# Altium project LPCB220__RLOOP__STEPPER_NODE.PrjPCB (part 2 of 2)

## Sheet LPCB220 - REMOTE ACCELS.SchDoc
size A3; Address1: Factory 10; Address2: 9-13 Dingley Avenue, Dandeong, VICTORIA 3175, AUSTRALIA; DocumentNumber: 14; Revision: 1; SheetNumber: 14; SheetTotal: 18; Lockie__PCB_SUB_ASSEMBLY: Remote Accelerometer System; Lockie__PCB_ASSEMBLY: Brake Control; Lockie__LDL: LPCB220; Lockie__PCB_DESCRIPTION: Redundant Stepper Node
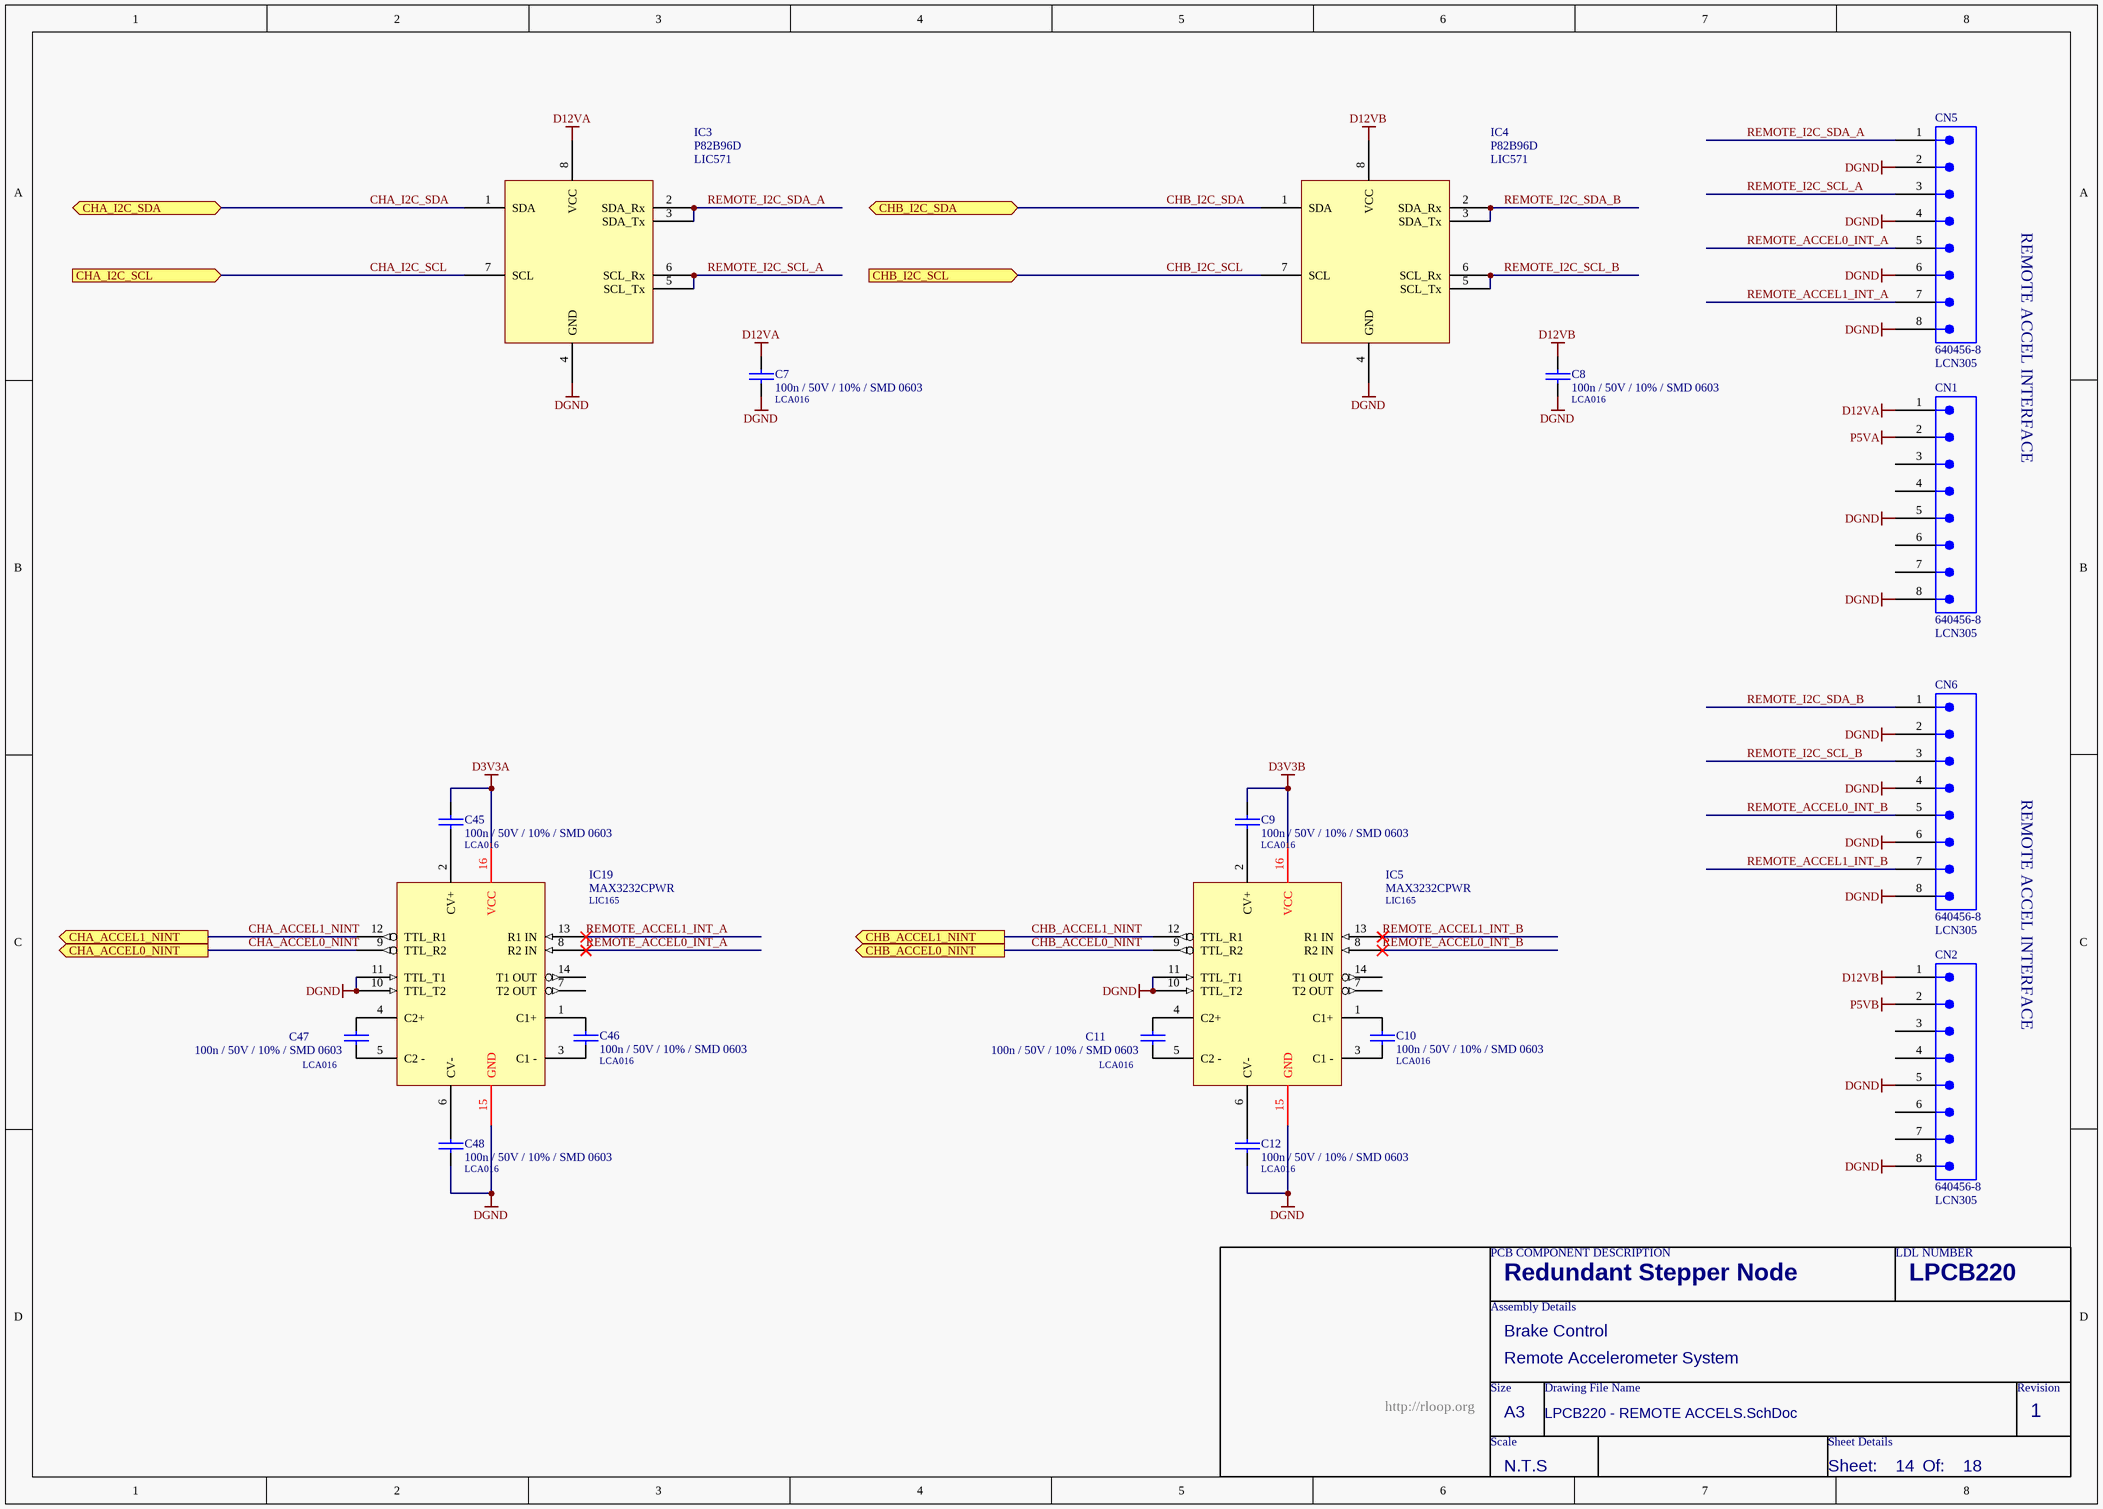
[diagram p12: LPCB220 - REMOTE ACCELS.SchDoc]

### Parts
C7  100n / 50V / 10% / SMD 0603  LDL_NUMBER: LCA016  [LFP011__CC1608-0603-IPC7351_B]
C8  100n / 50V / 10% / SMD 0603  LDL_NUMBER: LCA016  [LFP011__CC1608-0603-IPC7351_B]
C9  100n / 50V / 10% / SMD 0603  LDL_NUMBER: LCA016  [LFP011__CC1608-0603-IPC7351_B]
C10  100n / 50V / 10% / SMD 0603  LDL_NUMBER: LCA016  [LFP011__CC1608-0603-IPC7351_B]
C11  100n / 50V / 10% / SMD 0603  LDL_NUMBER: LCA016  [LFP011__CC1608-0603-IPC7351_B]
C12  100n / 50V / 10% / SMD 0603  LDL_NUMBER: LCA016  [LFP011__CC1608-0603-IPC7351_B]
C45  100n / 50V / 10% / SMD 0603  LDL_NUMBER: LCA016  [LFP011__CC1608-0603-IPC7351_B]
C46  100n / 50V / 10% / SMD 0603  LDL_NUMBER: LCA016  [LFP011__CC1608-0603-IPC7351_B]
C47  100n / 50V / 10% / SMD 0603  LDL_NUMBER: LCA016  [LFP011__CC1608-0603-IPC7351_B]
C48  100n / 50V / 10% / SMD 0603  LDL_NUMBER: LCA016  [LFP011__CC1608-0603-IPC7351_B]
CN1  640456-8  LDL_NUMBER: LCN305  [640456-8]
CN2  640456-8  LDL_NUMBER: LCN305  [640456-8]
CN5  640456-8  LDL_NUMBER: LCN305  [640456-8]
CN6  640456-8  LDL_NUMBER: LCN305  [640456-8]
IC3  P82B96D  LDL_NUMBER: LIC571  [LFP097__SOIC150-8]
IC4  P82B96D  LDL_NUMBER: LIC571  [LFP097__SOIC150-8]
IC5  MAX3232CPWR  LDL_NUMBER: LIC165  [LFP049__TSSOP-16]
IC19  MAX3232CPWR  LDL_NUMBER: LIC165  [LFP049__TSSOP-16]

### Ports
CHA_ACCEL0_NINT (out), CHA_ACCEL1_NINT (out), CHA_I2C_SCL (in), CHA_I2C_SDA (bidir), CHB_ACCEL0_NINT (out), CHB_ACCEL1_NINT (out), CHB_I2C_SCL (in), CHB_I2C_SDA (bidir)

### Nets
D3V3A: C45.1 IC19.16(VCC)
D3V3B: C9.1 IC5.16(VCC)
D12VA: C7.1 CN1.1 IC3.8(VCC)
D12VB: C8.1 CN2.1 IC4.8(VCC)
DGND: C7.2 C8.2 C12.2 C48.2 CN1.5 CN1.8 CN2.5 CN2.8 CN5.2 CN5.4 CN5.6 CN5.8 CN6.2 CN6.4 CN6.6 CN6.8 IC3.4(GND) IC4.4(GND) IC5.10(TTL_T2) IC5.11(TTL_T1) IC5.15(GND) IC19.10(TTL_T2) IC19.11(TTL_T1) IC19.15(GND)
P5VA: CN1.2
P5VB: CN2.2
CHA_ACCEL0_NINT: IC19.9(TTL_R2) ; port CHA_ACCEL0_NINT
CHA_ACCEL1_NINT: IC19.12(TTL_R1) ; port CHA_ACCEL1_NINT
CHA_I2C_SCL: IC3.7(SCL) ; port CHA_I2C_SCL
CHA_I2C_SDA: IC3.1(SDA) ; port CHA_I2C_SDA
CHB_ACCEL0_NINT: IC5.9(TTL_R2) ; port CHB_ACCEL0_NINT
CHB_ACCEL1_NINT: IC5.12(TTL_R1) ; port CHB_ACCEL1_NINT
CHB_I2C_SCL: IC4.7(SCL) ; port CHB_I2C_SCL
CHB_I2C_SDA: IC4.1(SDA) ; port CHB_I2C_SDA
REMOTE_ACCEL0_INT_A: CN5.5 IC19.8(R2_IN)
REMOTE_ACCEL0_INT_B: CN6.5 IC5.8(R2_IN)
REMOTE_ACCEL1_INT_A: CN5.7 IC19.13(R1_IN)
REMOTE_ACCEL1_INT_B: CN6.7 IC5.13(R1_IN)
REMOTE_I2C_SCL_A: CN5.3 IC3.5(SCL_Tx) IC3.6(SCL_Rx)
REMOTE_I2C_SCL_B: CN6.3 IC4.5(SCL_Tx) IC4.6(SCL_Rx)
REMOTE_I2C_SDA_A: CN5.1 IC3.2(SDA_Rx) IC3.3(SDA_Tx)
REMOTE_I2C_SDA_B: CN6.1 IC4.2(SDA_Rx) IC4.3(SDA_Tx)
NetC9_2: C9.2 IC5.2(CV+)
NetC10_1: C10.1 IC5.1(C1+)
NetC10_2: C10.2 IC5.3(C1_-)
NetC11_1: C11.1 IC5.4(C2+)
NetC11_2: C11.2 IC5.5(C2_-)
NetC12_1: C12.1 IC5.6(CV-)
NetC45_2: C45.2 IC19.2(CV+)
NetC46_1: C46.1 IC19.1(C1+)
NetC46_2: C46.2 IC19.3(C1_-)
NetC47_1: C47.1 IC19.4(C2+)
NetC47_2: C47.2 IC19.5(C2_-)
NetC48_1: C48.1 IC19.6(CV-)

Not connected (* = marked no-connect by the designer): CN1 3 4 6 7; CN2 3 4 6 7; IC5 7(T2_OUT) 14(T1_OUT); IC19 7(T2_OUT) 14(T1_OUT)

### Notes on the sheet
- REMOTE ACCEL INTERFACE
- PCB COMPONENT DESCRIPTION
- LDL NUMBER
- Assembly Details
- Size
- Drawing File Name
- Revision
- http://rloop.org
- Scale
- A3
- Sheet Details
- N.T.S
- Sheet:
- Of:

### Library data of the parts
C7 C8 = 100n / 50V / 10% / SMD 0603: as C2 on sheet LPCB220 - BRAKE FAILSAFE; Value: 100n; FMEDA__FUNCTION_IN_SYSTEM: *; FMEDA__OPERATING__VOLTAGE_TYP: 3.3
C9-C12 C45-C48 = 100n / 50V / 10% / SMD 0603: as C37 on sheet LPCB220 - PUSHER INTERLOCK; Value: 100n; FMEDA__FUNCTION_IN_SYSTEM: *; FMEDA__OPERATING__VOLTAGE_TYP: 3.3
CN1 CN2 CN5 CN6 = 640456-8: as CN7 on sheet LPCB220 - BRAKE FAILSAFE; FMEDA__FUNCTION_IN_SYSTEM: *; FMEDA__OPERATING__CURRENT_MIN: 0; FMEDA__OPERATING__CURRENT_TYP: 0; FMEDA__OPERATING__VOLTAGE_MIN: 0
IC3 IC4 = P82B96D: IC, I2C Line Driver [LIC571]
IC5 IC19 = MAX3232CPWR: as IC17 on sheet LPCB220 - PUSHER INTERLOCK; FMEDA__FUNCTION_IN_SYSTEM: *; FMEDA__OPERATING__VOLTAGE_TYP: 3.3

## Sheet LPCB220 - CORE B.SchDoc
size A3; Address1: Factory 10; Address2: 9-13 Dingley Avenue, Dandeong, VICTORIA 3175, AUSTRALIA; DocumentNumber: 5; Revision: 1; SheetNumber: 5; SheetTotal: 18; Lockie__PCB_SUB_ASSEMBLY: Node Core B; Lockie__PCB_ASSEMBLY: Brake Control; Lockie__LDL: LPCB220; Lockie__PCB_DESCRIPTION: Redundant Stepper Node
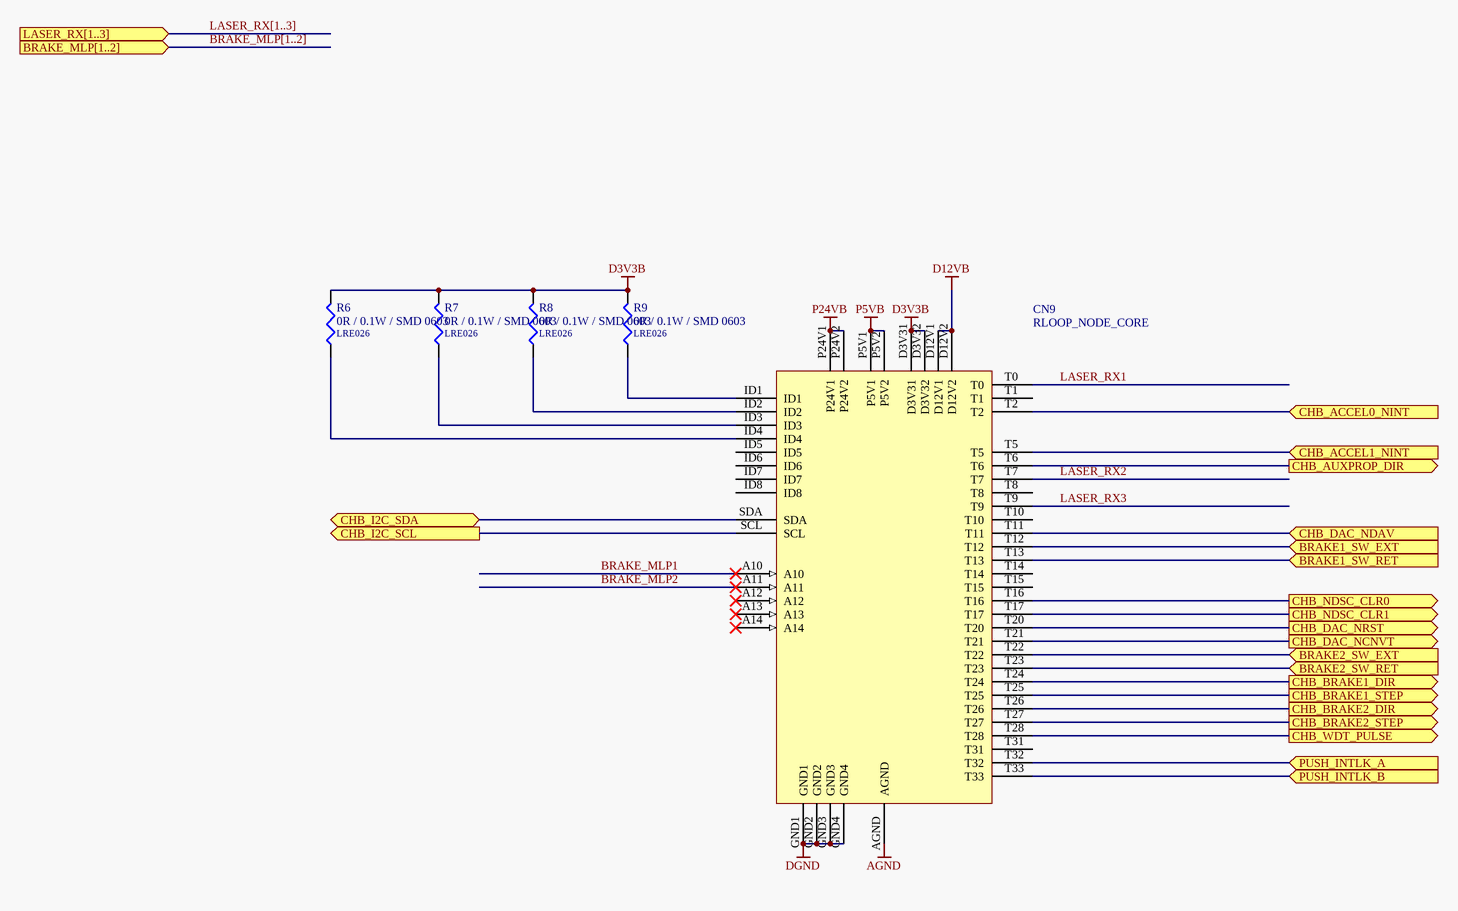
[diagram p13: LPCB220 - CORE B.SchDoc]

### Parts
CN9  RLOOP_NODE_CORE  [RLOOP_NODE_CORE]  (no BOM)
R6  0R / 0.1W / SMD 0603  LDL_NUMBER: LRE026  [LFP020__CR1608-0603-IPC7351_B]
R7  0R / 0.1W / SMD 0603  LDL_NUMBER: LRE026  [LFP020__CR1608-0603-IPC7351_B]
R8  0R / 0.1W / SMD 0603  LDL_NUMBER: LRE026  [LFP020__CR1608-0603-IPC7351_B]
R9  0R / 0.1W / SMD 0603  LDL_NUMBER: LRE026  [LFP020__CR1608-0603-IPC7351_B]

### Ports
BRAKE1_SW_EXT (in), BRAKE1_SW_RET (in), BRAKE2_SW_EXT (in), BRAKE2_SW_RET (in), BRAKE_MLP[1..2] (in), CHB_ACCEL0_NINT (in), CHB_ACCEL1_NINT (in), CHB_AUXPROP_DIR (out), CHB_BRAKE1_DIR (out), CHB_BRAKE1_STEP (out), CHB_BRAKE2_DIR (out), CHB_BRAKE2_STEP (out), CHB_DAC_NCNVT (out), CHB_DAC_NDAV (in), CHB_DAC_NRST (out), CHB_I2C_SCL (out), CHB_I2C_SDA (bidir), CHB_NDSC_CLR0 (out), CHB_NDSC_CLR1 (out), CHB_WDT_PULSE (out), LASER_RX[1..3] (in), PUSH_INTLK_A (in), PUSH_INTLK_B (in)

### Nets
AGND: CN9.AGND
D3V3B: CN9.D3V31 CN9.D3V32 R6.2 R7.2 R8.2 R9.2
D12VB: CN9.D12V1 CN9.D12V2
DGND: CN9.GND1 CN9.GND2 CN9.GND3 CN9.GND4
P5VB: CN9.P5V1 CN9.P5V2
P24VB: CN9.P24V1 CN9.P24V2
BRAKE1_SW_EXT: CN9.T12 ; port BRAKE1_SW_EXT
BRAKE1_SW_RET: CN9.T13 ; port BRAKE1_SW_RET
BRAKE2_SW_EXT: CN9.T22 ; port BRAKE2_SW_EXT
BRAKE2_SW_RET: CN9.T23 ; port BRAKE2_SW_RET
BRAKE_MLP1: CN9.A10
BRAKE_MLP2: CN9.A11
CHB_ACCEL0_NINT: CN9.T2 ; port CHB_ACCEL0_NINT
CHB_ACCEL1_NINT: CN9.T5 ; port CHB_ACCEL1_NINT
CHB_AUXPROP_DIR: CN9.T6 ; port CHB_AUXPROP_DIR
CHB_BRAKE1_DIR: CN9.T24 ; port CHB_BRAKE1_DIR
CHB_BRAKE1_STEP: CN9.T25 ; port CHB_BRAKE1_STEP
CHB_BRAKE2_DIR: CN9.T26 ; port CHB_BRAKE2_DIR
CHB_BRAKE2_STEP: CN9.T27 ; port CHB_BRAKE2_STEP
CHB_DAC_NCNVT: CN9.T21 ; port CHB_DAC_NCNVT
CHB_DAC_NDAV: CN9.T11 ; port CHB_DAC_NDAV
CHB_DAC_NRST: CN9.T20 ; port CHB_DAC_NRST
CHB_I2C_SCL: CN9.SCL ; port CHB_I2C_SCL
CHB_I2C_SDA: CN9.SDA ; port CHB_I2C_SDA
CHB_NDSC_CLR0: CN9.T16 ; port CHB_NDSC_CLR0
CHB_NDSC_CLR1: CN9.T17 ; port CHB_NDSC_CLR1
CHB_WDT_PULSE: CN9.T28 ; port CHB_WDT_PULSE
LASER_RX1: CN9.T0
LASER_RX2: CN9.T7
LASER_RX3: CN9.T9
PUSH_INTLK_A: CN9.T32 ; port PUSH_INTLK_A
PUSH_INTLK_B: CN9.T33 ; port PUSH_INTLK_B
NetCN9_ID1: CN9.ID1 R9.1
NetCN9_ID2: CN9.ID2 R8.1
NetCN9_ID3: CN9.ID3 R7.1
NetCN9_ID4: CN9.ID4 R6.1

Not connected (* = marked no-connect by the designer): CN9 A12* A13* A14* ID5 ID6 ID7 ID8 T1 T8 T10 T14 T15 T31

### Buses and harness runs
bus BRAKE_MLP[1..2] = port BRAKE_MLP[1..2]
bus LASER_RX[1..3] = port LASER_RX[1..3]

### Notes on the sheet
- PCB COMPONENT DESCRIPTION
- LDL NUMBER
- Assembly Details
- Size
- Drawing File Name
- Revision
- http://rloop.org
- Scale
- A3
- Sheet Details
- N.T.S
- Sheet:
- Of:

### Library data of the parts
CN9 = RLOOP_NODE_CORE: rLoop Node Core Connector; FMEDA__CHANNEL: COM; FMEDA__OPERATING__CURRENT_MAX: 0; FMEDA__OPERATING__TEMP_MAX: 50; FMEDA__OPERATING__TEMP_MIN: -20; FMEDA__OPERATING__TEMP_TYP: 27; FMEDA__OPERATING__VOLTAGE_MAX: 16; FMEDA__OPERATING__VOLTAGE_TYP: 12; FMEDA__OPERATING__CURRENT_MIN: 0; FMEDA__OPERATING__CURRENT_TYP: 0; FMEDA__OPERATING__VOLTAGE_MIN: 0
R6-R9 = 0R / 0.1W / SMD 0603: Resistor, Ceramic Chip, 0R, 0.1W, SMD 0603 [LRE026]; Value: 0; FMEDA__OPERATING__TEMP_MAX: 50; FMEDA__OPERATING__TEMP_MIN: -20; FMEDA__OPERATING__TEMP_TYP: 27; FMEDA__CHANNEL: COM; FMEDA__OPERATING__POWER_MAX: 0; FMEDA__OPERATING__POWER_MIN: 0; FMEDA__OPERATING__VOLTAGE_MAX: 0; FMEDA__OPERATING__VOLTAGE_MIN: 0; FMEDA__OPERATING__VOLTAGE_TYP: 0; FMEDA__FUNCTION_IN_SYSTEM: *

## Sheet LPCB220 - G210X MUX INTERFACE.SchDoc
size A3; Address1: Factory 10; Address2: 9-13 Dingley Avenue, Dandeong, VICTORIA 3175, AUSTRALIA; DocumentNumber: 8; Revision: 1; SheetNumber: 8; SheetTotal: 18; Lockie__PCB_SUB_ASSEMBLY: G210 Multiplexer Interface; Lockie__PCB_ASSEMBLY: Brake Control; Lockie__LDL: LPCB220; Lockie__PCB_DESCRIPTION: Redundant Stepper Node
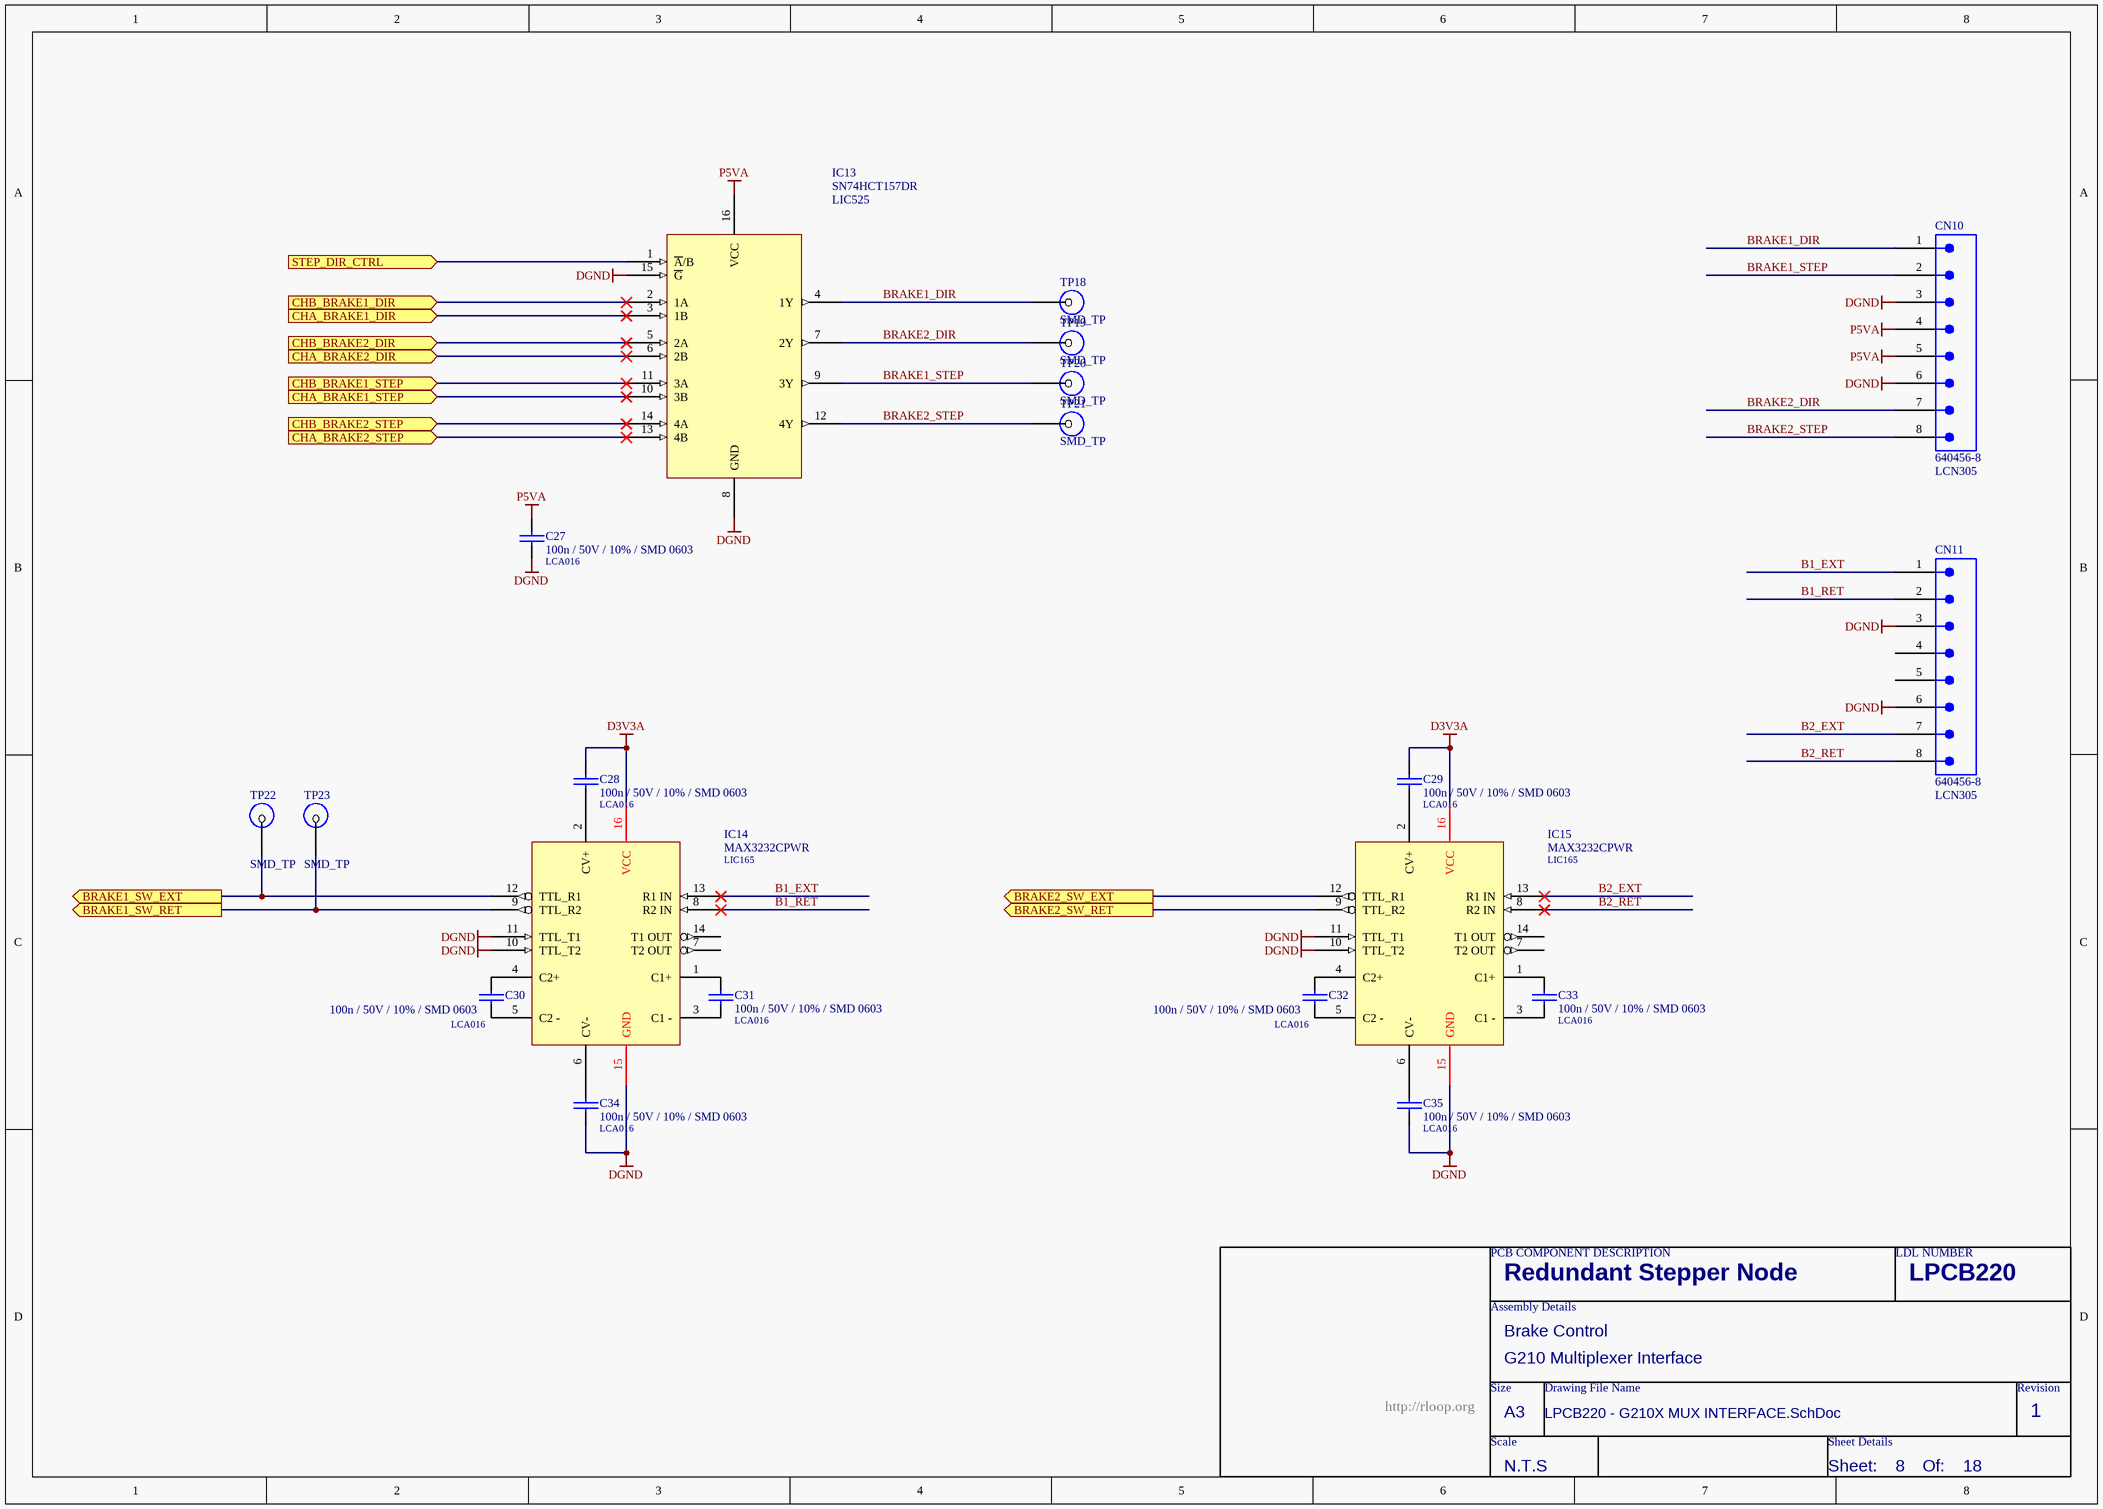
[diagram p14: LPCB220 - G210X MUX INTERFACE.SchDoc]

### Parts
C27  100n / 50V / 10% / SMD 0603  LDL_NUMBER: LCA016  [LFP011__CC1608-0603-IPC7351_B]
C28  100n / 50V / 10% / SMD 0603  LDL_NUMBER: LCA016  [LFP011__CC1608-0603-IPC7351_B]
C29  100n / 50V / 10% / SMD 0603  LDL_NUMBER: LCA016  [LFP011__CC1608-0603-IPC7351_B]
C30  100n / 50V / 10% / SMD 0603  LDL_NUMBER: LCA016  [LFP011__CC1608-0603-IPC7351_B]
C31  100n / 50V / 10% / SMD 0603  LDL_NUMBER: LCA016  [LFP011__CC1608-0603-IPC7351_B]
C32  100n / 50V / 10% / SMD 0603  LDL_NUMBER: LCA016  [LFP011__CC1608-0603-IPC7351_B]
C33  100n / 50V / 10% / SMD 0603  LDL_NUMBER: LCA016  [LFP011__CC1608-0603-IPC7351_B]
C34  100n / 50V / 10% / SMD 0603  LDL_NUMBER: LCA016  [LFP011__CC1608-0603-IPC7351_B]
C35  100n / 50V / 10% / SMD 0603  LDL_NUMBER: LCA016  [LFP011__CC1608-0603-IPC7351_B]
CN10  640456-8  LDL_NUMBER: LCN305  [640456-8]
CN11  640456-8  LDL_NUMBER: LCN305  [640456-8]
IC13  SN74HCT157DR  LDL_NUMBER: LIC525  [LFP079__SOP16]
IC14  MAX3232CPWR  LDL_NUMBER: LIC165  [LFP049__TSSOP-16]
IC15  MAX3232CPWR  LDL_NUMBER: LIC165  [LFP049__TSSOP-16]
TP18  SMD_TP  [SMD-TP]  (no BOM)
TP19  SMD_TP  [SMD-TP]  (no BOM)
TP20  SMD_TP  [SMD-TP]  (no BOM)
TP21  SMD_TP  [SMD-TP]  (no BOM)
TP22  SMD_TP  [SMD-TP]  (no BOM)
TP23  SMD_TP  [SMD-TP]  (no BOM)

### Ports
BRAKE1_SW_EXT (out), BRAKE1_SW_RET (out), BRAKE2_SW_EXT (out), BRAKE2_SW_RET (out), CHA_BRAKE1_DIR (in), CHA_BRAKE1_STEP (in), CHA_BRAKE2_DIR (in), CHA_BRAKE2_STEP (in), CHB_BRAKE1_DIR (in), CHB_BRAKE1_STEP (in), CHB_BRAKE2_DIR (in), CHB_BRAKE2_STEP (in), STEP_DIR_CTRL (in)

### Nets
D3V3A: C28.1 C29.1 IC14.16(VCC) IC15.16(VCC)
DGND: C27.2 C34.2 C35.2 CN10.3 CN10.6 CN11.3 CN11.6 IC13.8(GND) IC13.15(~{G}) IC14.10(TTL_T2) IC14.11(TTL_T1) IC14.15(GND) IC15.10(TTL_T2) IC15.11(TTL_T1) IC15.15(GND)
P5VA: C27.1 CN10.4 CN10.5 IC13.16(VCC)
B1_EXT: CN11.1 IC14.13(R1_IN)
B1_RET: CN11.2 IC14.8(R2_IN)
B2_EXT: CN11.7 IC15.13(R1_IN)
B2_RET: CN11.8 IC15.8(R2_IN)
BRAKE1_DIR: CN10.1 IC13.4(1Y) TP18.1
BRAKE1_STEP: CN10.2 IC13.9(3Y) TP20.1
BRAKE1_SW_EXT: IC14.12(TTL_R1) TP22.1 ; port BRAKE1_SW_EXT
BRAKE1_SW_RET: IC14.9(TTL_R2) TP23.1 ; port BRAKE1_SW_RET
BRAKE2_DIR: CN10.7 IC13.7(2Y) TP19.1
BRAKE2_STEP: CN10.8 IC13.12(4Y) TP21.1
BRAKE2_SW_EXT: IC15.12(TTL_R1) ; port BRAKE2_SW_EXT
BRAKE2_SW_RET: IC15.9(TTL_R2) ; port BRAKE2_SW_RET
CHA_BRAKE1_DIR: IC13.3(1B) ; port CHA_BRAKE1_DIR
CHA_BRAKE1_STEP: IC13.10(3B) ; port CHA_BRAKE1_STEP
CHA_BRAKE2_DIR: IC13.6(2B) ; port CHA_BRAKE2_DIR
CHA_BRAKE2_STEP: IC13.13(4B) ; port CHA_BRAKE2_STEP
CHB_BRAKE1_DIR: IC13.2(1A) ; port CHB_BRAKE1_DIR
CHB_BRAKE1_STEP: IC13.11(3A) ; port CHB_BRAKE1_STEP
CHB_BRAKE2_DIR: IC13.5(2A) ; port CHB_BRAKE2_DIR
CHB_BRAKE2_STEP: IC13.14(4A) ; port CHB_BRAKE2_STEP
STEP_DIR_CTRL: IC13.1(~{A}/B) ; port STEP_DIR_CTRL
NetC28_2: C28.2 IC14.2(CV+)
NetC29_2: C29.2 IC15.2(CV+)
NetC30_1: C30.1 IC14.4(C2+)
NetC30_2: C30.2 IC14.5(C2_-)
NetC31_1: C31.1 IC14.1(C1+)
NetC31_2: C31.2 IC14.3(C1_-)
NetC32_1: C32.1 IC15.4(C2+)
NetC32_2: C32.2 IC15.5(C2_-)
NetC33_1: C33.1 IC15.1(C1+)
NetC33_2: C33.2 IC15.3(C1_-)
NetC34_1: C34.1 IC14.6(CV-)
NetC35_1: C35.1 IC15.6(CV-)

Not connected (* = marked no-connect by the designer): CN11 4 5; IC14 7(T2_OUT) 14(T1_OUT); IC15 7(T2_OUT) 14(T1_OUT)

### Notes on the sheet
- PCB COMPONENT DESCRIPTION
- LDL NUMBER
- Assembly Details
- Size
- Drawing File Name
- Revision
- http://rloop.org
- Scale
- A3
- Sheet Details
- N.T.S
- Sheet:
- Of:

### Library data of the parts
C27 = 100n / 50V / 10% / SMD 0603: Capacitor, Ceramic Chip, 100nF (0.1uF), 50V, 5%, SMD 0603 [LCA016]; FMEDA__OPERATING__VOLTAGE_MIN: 0; FMEDA__OPERATING__VOLTAGE_MAX: 3.3; FMEDA__OPERATING__TEMP_MIN: -20; FMEDA__OPERATING__TEMP_TYP: 27; FMEDA__OPERATING__TEMP_MAX: 50; FMEDA__CHANNEL: COM; Value: 100n; FMEDA__FUNCTION_IN_SYSTEM: *; FMEDA__OPERATING__VOLTAGE_TYP: 3.3
C28-C35 = 100n / 50V / 10% / SMD 0603: Capacitor, Ceramic Chip, 100nF, 50V, 10%, SMD 0603; FMEDA__OPERATING__VOLTAGE_MIN: 0; FMEDA__OPERATING__VOLTAGE_MAX: 3.3; FMEDA__OPERATING__TEMP_MIN: -20; FMEDA__OPERATING__TEMP_TYP: 27; FMEDA__OPERATING__TEMP_MAX: 50; FMEDA__CHANNEL: COM; Value: 100n; FMEDA__FUNCTION_IN_SYSTEM: *; FMEDA__OPERATING__VOLTAGE_TYP: 3.3
CN10 CN11 = 640456-8: Connector, Male Header, 8 Way; FMEDA__CHANNEL: COM; FMEDA__OPERATING__CURRENT_MAX: 0; FMEDA__OPERATING__TEMP_MAX: 50; FMEDA__OPERATING__TEMP_MIN: -20; FMEDA__OPERATING__TEMP_TYP: 27; FMEDA__OPERATING__VOLTAGE_MAX: 16; FMEDA__OPERATING__VOLTAGE_TYP: 12; FMEDA__FUNCTION_IN_SYSTEM: *; FMEDA__OPERATING__CURRENT_MIN: 0; FMEDA__OPERATING__CURRENT_TYP: 0; FMEDA__OPERATING__VOLTAGE_MIN: 0
IC13 = SN74HCT157DR: IC, Multiplexer Select 2-1 [LIC525]; FMEDA__CHANNEL: COM; FMEDA__FUNCTION_IN_SYSTEM: *
IC14 IC15 = MAX3232CPWR: IC, RS232 Line Driver, 3.3V, SMD TSSOP16; FMEDA__OPERATING__TEMP_MAX: 50; FMEDA__OPERATING__TEMP_MIN: -20; FMEDA__OPERATING__TEMP_TYP: 27; FMEDA__CHANNEL: COM; FMEDA__OPERATING__VOLTAGE_MAX: 3.3; FMEDA__OPERATING__VOLTAGE_MIN: 0; FMEDA__FUNCTION_IN_SYSTEM: *; FMEDA__OPERATING__VOLTAGE_TYP: 3.3
TP18-TP23 = SMD_TP: SMD Test Point; FMEDA__CHANNEL: COM; FMEDA__OPERATING__CURRENT_MAX: 0; FMEDA__OPERATING__TEMP_MAX: 50; FMEDA__OPERATING__TEMP_MIN: -20; FMEDA__OPERATING__TEMP_TYP: 27; FMEDA__OPERATING__VOLTAGE_MAX: 16; FMEDA__OPERATING__VOLTAGE_TYP: 12; FMEDA__OPERATING__CURRENT_MIN: 0; FMEDA__OPERATING__CURRENT_TYP: 0; FMEDA__OPERATING__VOLTAGE_MIN: 0

## Sheet LPCB220 - THROTTLE MUX TOP.SchDoc
size A3; Address1: Factory 10; Address2: 9-13 Dingley Avenue, Dandeong, VICTORIA 3175, AUSTRALIA; DocumentNumber: 15; Revision: 1; SheetNumber: 15; SheetTotal: 18; Lockie__PCB_SUB_ASSEMBLY: Throttle Multiplexers; Lockie__PCB_ASSEMBLY: Brake Control; Lockie__LDL: LPCB220; Lockie__PCB_DESCRIPTION: Redundant Stepper Node
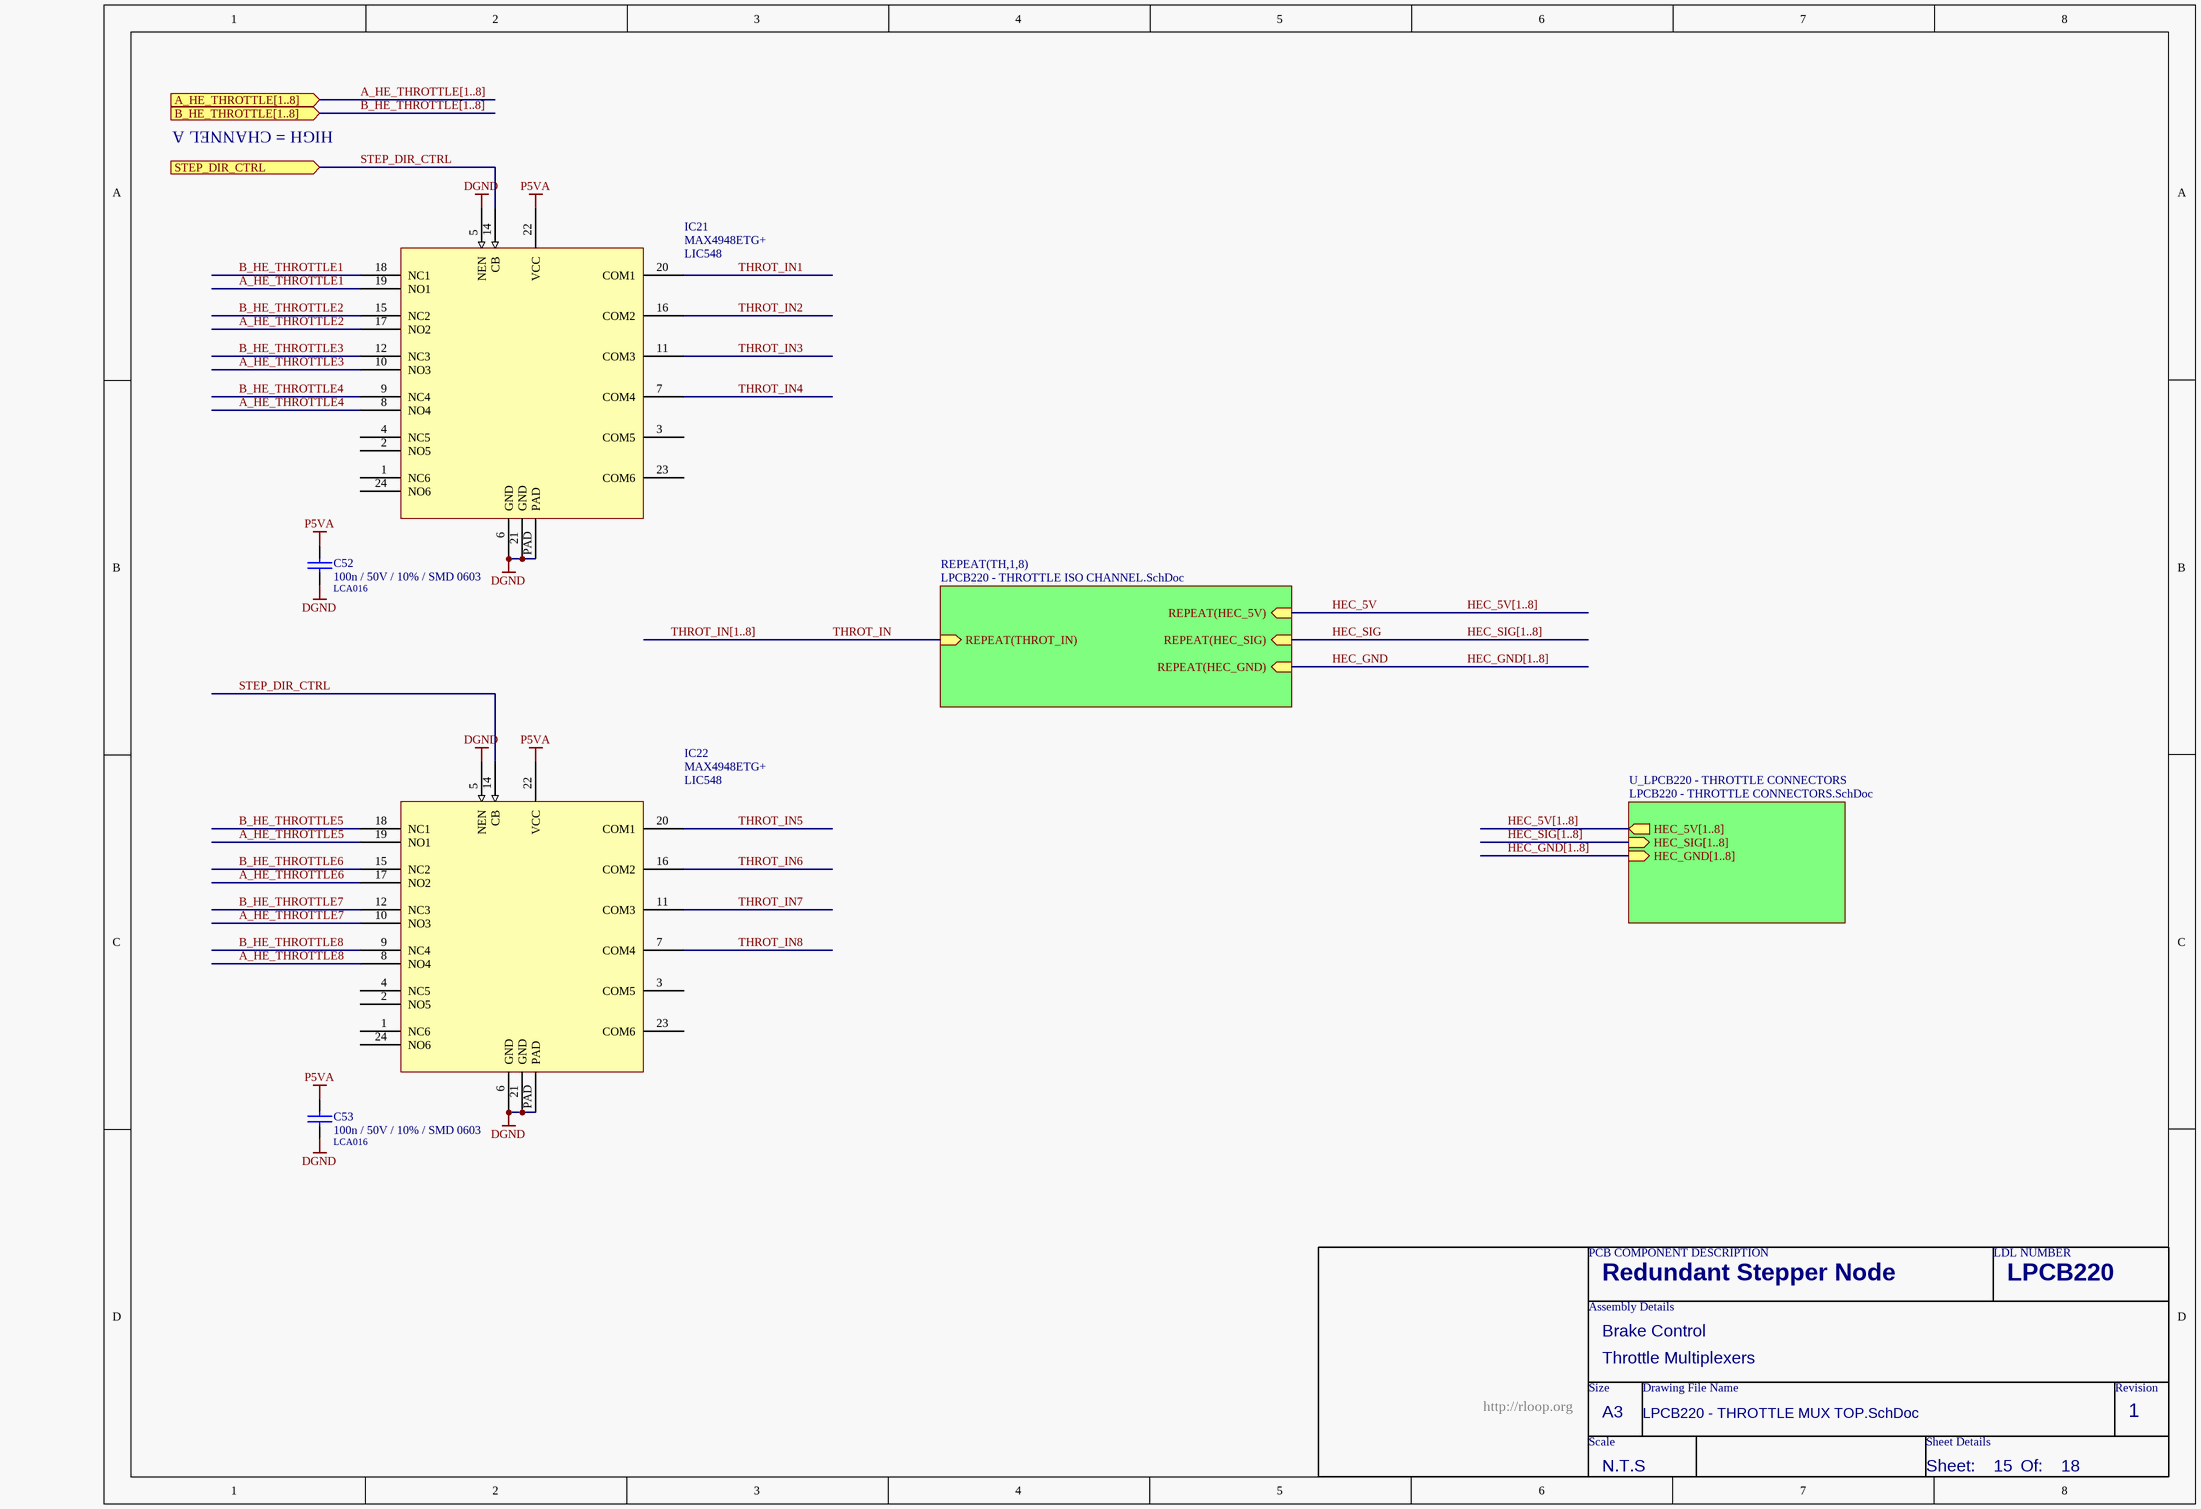
[diagram p15: LPCB220 - THROTTLE MUX TOP.SchDoc]

### Parts
C52  100n / 50V / 10% / SMD 0603  LDL_NUMBER: LCA016  [LFP011__CC1608-0603-IPC7351_B]
C53  100n / 50V / 10% / SMD 0603  LDL_NUMBER: LCA016  [LFP011__CC1608-0603-IPC7351_B]
IC21  MAX4948ETG+  LDL_NUMBER: LIC548  [LFP095__QFN127P600-8N]
IC22  MAX4948ETG+  LDL_NUMBER: LIC548  [LFP095__QFN127P600-8N]

### Sub-sheets
REPEAT(TH,1,8) = LPCB220 - THROTTLE ISO CHANNEL.SchDoc: REPEAT(THROT_IN) (in), REPEAT(HEC_5V) (in), REPEAT(HEC_GND) (in), REPEAT(HEC_SIG) (in)
U_LPCB220 - THROTTLE CONNECTORS = LPCB220 - THROTTLE CONNECTORS.SchDoc: HEC_5V[1..8] (out), HEC_SIG[1..8] (in), HEC_GND[1..8] (in)

### Ports
A_HE_THROTTLE[1..8] (in), B_HE_THROTTLE[1..8] (in), STEP_DIR_CTRL (in)

### Nets
DGND: C52.2 C53.2 IC21.5(NEN) IC21.6(GND) IC21.21(GND) IC21.PAD IC22.5(NEN) IC22.6(GND) IC22.21(GND) IC22.PAD
P5VA: C52.1 C53.1 IC21.22(VCC) IC22.22(VCC)
A_HE_THROTTLE1: IC21.19(NO1)
A_HE_THROTTLE2: IC21.17(NO2)
A_HE_THROTTLE3: IC21.10(NO3)
A_HE_THROTTLE4: IC21.8(NO4)
A_HE_THROTTLE5: IC22.19(NO1)
A_HE_THROTTLE6: IC22.17(NO2)
A_HE_THROTTLE7: IC22.10(NO3)
A_HE_THROTTLE8: IC22.8(NO4)
B_HE_THROTTLE1: IC21.18(NC1)
B_HE_THROTTLE2: IC21.15(NC2)
B_HE_THROTTLE3: IC21.12(NC3)
B_HE_THROTTLE4: IC21.9(NC4)
B_HE_THROTTLE5: IC22.18(NC1)
B_HE_THROTTLE6: IC22.15(NC2)
B_HE_THROTTLE7: IC22.12(NC3)
B_HE_THROTTLE8: IC22.9(NC4)
HEC_5V: sheet REPEAT(TH,1,8)/REPEAT(HEC_5V)
HEC_GND: sheet REPEAT(TH,1,8)/REPEAT(HEC_GND)
HEC_SIG: sheet REPEAT(TH,1,8)/REPEAT(HEC_SIG)
STEP_DIR_CTRL: IC21.14(CB) IC22.14(CB) ; port STEP_DIR_CTRL
THROT_IN: sheet REPEAT(TH,1,8)/REPEAT(THROT_IN)
THROT_IN1: IC21.20(COM1)
THROT_IN2: IC21.16(COM2)
THROT_IN3: IC21.11(COM3)
THROT_IN4: IC21.7(COM4)
THROT_IN5: IC22.20(COM1)
THROT_IN6: IC22.16(COM2)
THROT_IN7: IC22.11(COM3)
THROT_IN8: IC22.7(COM4)

Not connected (* = marked no-connect by the designer): IC21 1(NC6) 2(NO5) 3(COM5) 4(NC5) 23(COM6) 24(NO6); IC22 1(NC6) 2(NO5) 3(COM5) 4(NC5) 23(COM6) 24(NO6)

### Buses and harness runs
bus A_HE_THROTTLE[1..8] = port A_HE_THROTTLE[1..8]
bus B_HE_THROTTLE[1..8] = port B_HE_THROTTLE[1..8]
bus HEC_5V[1..8]
bus HEC_5V[1..8] = sheet U_LPCB220 - THROTTLE CONNECTORS/HEC_5V[1..8]
bus HEC_GND[1..8]
bus HEC_GND[1..8] = sheet U_LPCB220 - THROTTLE CONNECTORS/HEC_GND[1..8]
bus HEC_SIG[1..8]
bus HEC_SIG[1..8] = sheet U_LPCB220 - THROTTLE CONNECTORS/HEC_SIG[1..8]
bus THROT_IN[1..8]

### Notes on the sheet
- HIGH = CHANNEL A
- PCB COMPONENT DESCRIPTION
- LDL NUMBER
- Assembly Details
- Size
- Drawing File Name
- Revision
- http://rloop.org
- Scale
- A3
- Sheet Details
- N.T.S
- Sheet:
- Of:

### Library data of the parts
C52 C53 = 100n / 50V / 10% / SMD 0603: as C27 on sheet LPCB220 - G210X MUX INTERFACE; Value: 100n; FMEDA__FUNCTION_IN_SYSTEM: *; FMEDA__OPERATING__VOLTAGE_TYP: 3.3
IC21 IC22 = MAX4948ETG+: IC, Analog Switch, SMD [LIC548]

## Sheet LPCB220 - THROTTLE ISO CHANNEL.SchDoc
size A3; Address1: Factory 10; Address2: 9-13 Dingley Avenue, Dandeong, VICTORIA 3175, AUSTRALIA; DocumentNumber: 17; Revision: 1; SheetNumber: 17; SheetTotal: 18; Lockie__PCB_SUB_ASSEMBLY: Isolated Throttle Channel; Lockie__PCB_ASSEMBLY: Brake Control; Lockie__LDL: LPCB220; Lockie__PCB_DESCRIPTION: Redundant Stepper Node
Used 8 times, as channels U_LPCB220 - THROTTLE MUX TOP/TH1, U_LPCB220 - THROTTLE MUX TOP/TH2, U_LPCB220 - THROTTLE MUX TOP/TH3, U_LPCB220 - THROTTLE MUX TOP/TH4, U_LPCB220 - THROTTLE MUX TOP/TH5, U_LPCB220 - THROTTLE MUX TOP/TH6, U_LPCB220 - THROTTLE MUX TOP/TH7, U_LPCB220 - THROTTLE MUX TOP/TH8. Parts and nets are listed once, with the designators drawn on the sheet.
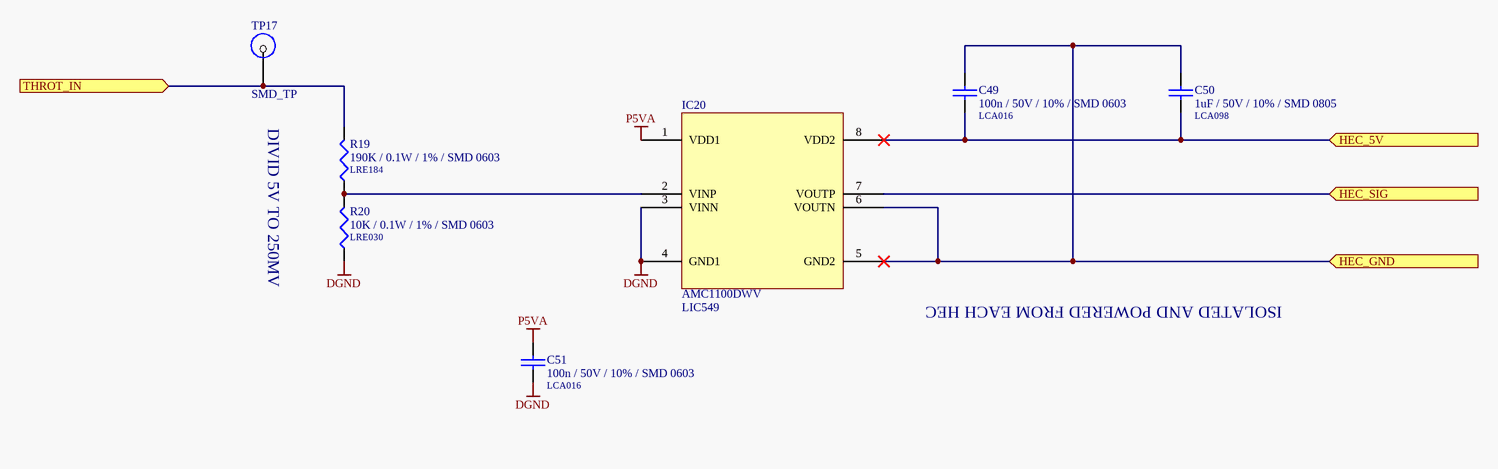
[diagram p16: LPCB220 - THROTTLE ISO CHANNEL.SchDoc]

### Parts
C49  100n / 50V / 10% / SMD 0603  LDL_NUMBER: LCA016  [LFP011__CC1608-0603-IPC7351_B]
C50  1uF / 50V / 10% / SMD 0805  LDL_NUMBER: LCA098  [LFP010__CC2012-0805-IPC7351_B]
C51  100n / 50V / 10% / SMD 0603  LDL_NUMBER: LCA016  [LFP011__CC1608-0603-IPC7351_B]
IC20  AMC1100DWV  LDL_NUMBER: LIC549  [LFP116__R-PDSO-G8]
R19  190K / 0.1W / 1% / SMD 0603  LDL_NUMBER: LRE184  [LFP020__CR1608-0603-IPC7351_B]
R20  10K / 0.1W / 1% / SMD 0603  LDL_NUMBER: LRE030  [LFP020__CR1608-0603-IPC7351_B]
TP17  SMD_TP  [SMD-TP]  (no BOM)

### Ports
HEC_5V (in), HEC_GND (in), HEC_SIG (in), THROT_IN (in)

### Nets
DGND: C51.2 IC20.3(VINN) IC20.4(GND1) R20.1
P5VA: C51.1 IC20.1(VDD1)
HEC_5V: C49.2 C50.2 IC20.8(VDD2) ; port HEC_5V
HEC_GND: C49.1 C50.1 IC20.5(GND2) IC20.6(VOUTN) ; port HEC_GND
HEC_SIG: IC20.7(VOUTP) ; port HEC_SIG
THROT_IN: R19.2 TP17.1 ; port THROT_IN
NetIC20_2: IC20.2(VINP) R19.1 R20.2

### Channels
U_LPCB220 - THROTTLE MUX TOP/TH1: designators end in _TH1; ports HEC_5V=HEC_5V1 HEC_GND=HEC_GND1 HEC_SIG=HEC_SIG1 THROT_IN=THROT_IN1
U_LPCB220 - THROTTLE MUX TOP/TH2: designators end in _TH2; ports HEC_5V=HEC_5V2 HEC_GND=HEC_GND2 HEC_SIG=HEC_SIG2 THROT_IN=THROT_IN2
U_LPCB220 - THROTTLE MUX TOP/TH3: designators end in _TH3; ports HEC_5V=HEC_5V3 HEC_GND=HEC_GND3 HEC_SIG=HEC_SIG3 THROT_IN=THROT_IN3
U_LPCB220 - THROTTLE MUX TOP/TH4: designators end in _TH4; ports HEC_5V=HEC_5V4 HEC_GND=HEC_GND4 HEC_SIG=HEC_SIG4 THROT_IN=THROT_IN4
U_LPCB220 - THROTTLE MUX TOP/TH5: designators end in _TH5; ports HEC_5V=HEC_5V5 HEC_GND=HEC_GND5 HEC_SIG=HEC_SIG5 THROT_IN=THROT_IN5
U_LPCB220 - THROTTLE MUX TOP/TH6: designators end in _TH6; ports HEC_5V=HEC_5V6 HEC_GND=HEC_GND6 HEC_SIG=HEC_SIG6 THROT_IN=THROT_IN6
U_LPCB220 - THROTTLE MUX TOP/TH7: designators end in _TH7; ports HEC_5V=HEC_5V7 HEC_GND=HEC_GND7 HEC_SIG=HEC_SIG7 THROT_IN=THROT_IN7
U_LPCB220 - THROTTLE MUX TOP/TH8: designators end in _TH8; ports HEC_5V=HEC_5V8 HEC_GND=HEC_GND8 HEC_SIG=HEC_SIG8 THROT_IN=THROT_IN8

### Notes on the sheet
- DIVID 5V TO 250MV
- ISOLATED AND POWERED FROM EACH HEC
- PCB COMPONENT DESCRIPTION
- LDL NUMBER
- Assembly Details
- Size
- Drawing File Name
- Revision
- http://rloop.org
- Scale
- A3
- Sheet Details
- N.T.S
- Sheet:
- Of:

### Library data of the parts
C49 C51 = 100n / 50V / 10% / SMD 0603: as C27 on sheet LPCB220 - G210X MUX INTERFACE; Value: 100n; FMEDA__FUNCTION_IN_SYSTEM: *; FMEDA__OPERATING__VOLTAGE_TYP: 3.3
C50 = 1uF / 50V / 10% / SMD 0805: Capacitor, Ceramic Chip, 1uF, 50V, SMD 0805 [LCA098]; Value: 1u; FMEDA__OPERATING__VOLTAGE_MAX: 3.3; FMEDA__OPERATING__VOLTAGE_MIN: 0; FMEDA__OPERATING__TEMP_MAX: 50; FMEDA__OPERATING__TEMP_MIN: -20; FMEDA__OPERATING__TEMP_TYP: 27; FMEDA__CHANNEL: COM; FMEDA__OPERATING__VOLTAGE_TYP: 3.3; FMEDA__FUNCTION_IN_SYSTEM: *
IC20 = AMC1100DWV: IC, Isolation Amplifier, SMD SOIC8 [LIC549]
R19 = 190K / 0.1W / 1% / SMD 0603: Resistor, Ceramic Chip, 190K, 0.1W, 1%, SMD 0603 [LRE184]; FMEDA__OPERATING__POWER_MAX: 0; FMEDA__OPERATING__TEMP_MAX: 50; FMEDA__OPERATING__TEMP_MIN: -20; FMEDA__OPERATING__TEMP_TYP: 27; FMEDA__CHANNEL: COM; Value: 190K; FMEDA__OPERATING__POWER_MIN: 0; FMEDA__OPERATING__VOLTAGE_MAX: 0; FMEDA__OPERATING__VOLTAGE_MIN: 0; FMEDA__OPERATING__VOLTAGE_TYP: 0; FMEDA__FUNCTION_IN_SYSTEM: *
R20 = 10K / 0.1W / 1% / SMD 0603: Resistor, Ceramic Chip, 10K, 0.1W, 1%, SMD 0603 [LRE030]; FMEDA__OPERATING__POWER_MAX: 0; FMEDA__OPERATING__TEMP_MAX: 50; FMEDA__OPERATING__TEMP_MIN: -20; FMEDA__OPERATING__TEMP_TYP: 27; FMEDA__CHANNEL: COM; Value: 10K; FMEDA__OPERATING__POWER_MIN: 0; FMEDA__OPERATING__VOLTAGE_MAX: 0; FMEDA__OPERATING__VOLTAGE_MIN: 0; FMEDA__OPERATING__VOLTAGE_TYP: 0; FMEDA__FUNCTION_IN_SYSTEM: *
TP17 = SMD_TP: as TP18-TP23 on sheet LPCB220 - G210X MUX INTERFACE; FMEDA__OPERATING__CURRENT_MIN: 0; FMEDA__OPERATING__CURRENT_TYP: 0; FMEDA__OPERATING__VOLTAGE_MIN: 0

## Sheet LPCB220 - THROTTLE CONNECTORS.SchDoc
size A3; Address1: Factory 10; Address2: 9-13 Dingley Avenue, Dandeong, VICTORIA 3175, AUSTRALIA; DocumentNumber: 16; Revision: 1; SheetNumber: 16; SheetTotal: 18; Lockie__PCB_SUB_ASSEMBLY: Throttle Connections; Lockie__PCB_ASSEMBLY: Brake Control; Lockie__LDL: LPCB220; Lockie__PCB_DESCRIPTION: Redundant Stepper Node
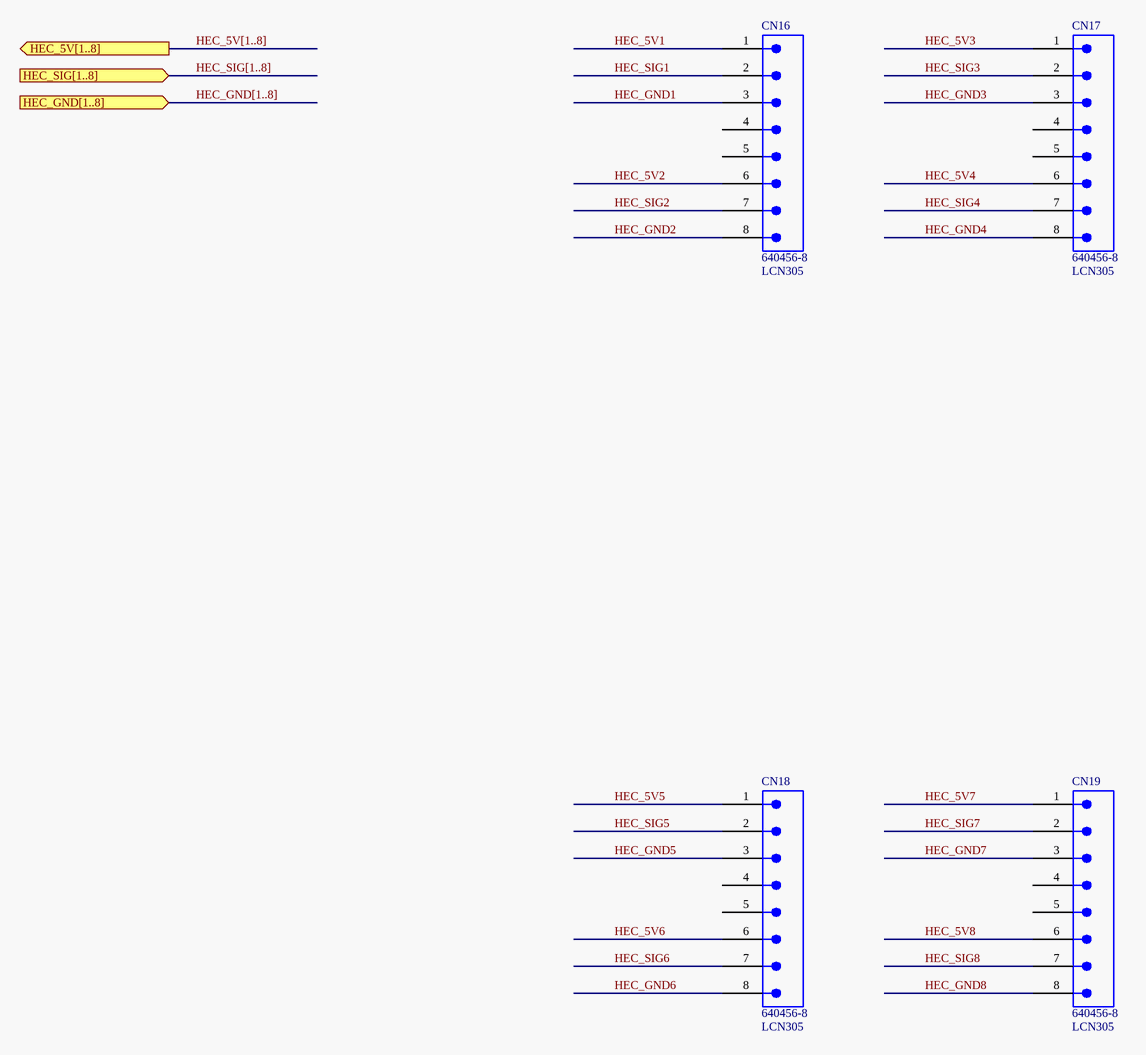
[diagram p17: LPCB220 - THROTTLE CONNECTORS.SchDoc]

### Parts
CN16  640456-8  LDL_NUMBER: LCN305  [640456-8]
CN17  640456-8  LDL_NUMBER: LCN305  [640456-8]
CN18  640456-8  LDL_NUMBER: LCN305  [640456-8]
CN19  640456-8  LDL_NUMBER: LCN305  [640456-8]

### Ports
HEC_5V[1..8] (out), HEC_GND[1..8] (in), HEC_SIG[1..8] (in)

### Nets
HEC_5V1: CN16.1
HEC_5V2: CN16.6
HEC_5V3: CN17.1
HEC_5V4: CN17.6
HEC_5V5: CN18.1
HEC_5V6: CN18.6
HEC_5V7: CN19.1
HEC_5V8: CN19.6
HEC_GND1: CN16.3
HEC_GND2: CN16.8
HEC_GND3: CN17.3
HEC_GND4: CN17.8
HEC_GND5: CN18.3
HEC_GND6: CN18.8
HEC_GND7: CN19.3
HEC_GND8: CN19.8
HEC_SIG1: CN16.2
HEC_SIG2: CN16.7
HEC_SIG3: CN17.2
HEC_SIG4: CN17.7
HEC_SIG5: CN18.2
HEC_SIG6: CN18.7
HEC_SIG7: CN19.2
HEC_SIG8: CN19.7

Not connected (* = marked no-connect by the designer): CN16 4 5; CN17 4 5; CN18 4 5; CN19 4 5

### Buses and harness runs
bus HEC_5V[1..8] = port HEC_5V[1..8]
bus HEC_GND[1..8] = port HEC_GND[1..8]
bus HEC_SIG[1..8] = port HEC_SIG[1..8]

### Notes on the sheet
- PCB COMPONENT DESCRIPTION
- LDL NUMBER
- Assembly Details
- Size
- Drawing File Name
- Revision
- http://rloop.org
- Scale
- A3
- Sheet Details
- N.T.S
- Sheet:
- Of:

### Library data of the parts
CN16-CN19 = 640456-8: as CN10 on sheet LPCB220 - G210X MUX INTERFACE; FMEDA__FUNCTION_IN_SYSTEM: *; FMEDA__OPERATING__CURRENT_MIN: 0; FMEDA__OPERATING__CURRENT_TYP: 0; FMEDA__OPERATING__VOLTAGE_MIN: 0

## Nets that join several sheets
AGND: U_LPCB220 - MLP INTERFACE/BL1 (9 pins), U_LPCB220 - MLP INTERFACE/BL2 (9 pins), LPCB220 - CORE A (CN8.AGND), LPCB220 - CORE B (CN9.AGND)
D3V3A: LPCB220 - BRAKE FAILSAFE (C2.1 C3.1 IC7.5 IC8.5), LPCB220 - WATCHDOG (5 pins), LPCB220 - PUSHER INTERLOCK (C37.1 IC17.10 IC17.16), LPCB220 - DAC A (5 pins), LPCB220 - CORE A (6 pins), LPCB220 - REMOTE ACCELS (C45.1 IC19.16), LPCB220 - G210X MUX INTERFACE (C28.1 C29.1 IC14.16 IC15.16)
D3V3B: LPCB220 - WATCHDOG (C56.1 IC25.5 R22.2), LPCB220 - PUSHER INTERLOCK (C41.1 IC18.10 IC18.16), LPCB220 - DAC B (5 pins), LPCB220 - REMOTE ACCELS (C9.1 IC5.16), LPCB220 - CORE B (6 pins)
D12VA: LPCB220 - CORE A (CN8.D12V1 CN8.D12V2), LPCB220 - REMOTE ACCELS (C7.1 CN1.1 IC3.8)
D12VB: LPCB220 - REMOTE ACCELS (C8.1 CN2.1 IC4.8), LPCB220 - CORE B (CN9.D12V1 CN9.D12V2)
DGND: LPCB220 - BRAKE FAILSAFE (5 pins), LPCB220 - WATCHDOG (6 pins), LPCB220 - PUSHER INTERLOCK (8 pins), LPCB220 - AUXPROP INTERFACE (14 pins), LPCB220 - DAC A (19 pins), LPCB220 - DAC B (19 pins), U_LPCB220 - IBEAM INTERFACE/L1 (C36_L1.2 CN12_L1.7 CN12_L1.8 IC16_L1.4), U_LPCB220 - IBEAM INTERFACE/L2 (C36_L2.2 CN12_L2.7 CN12_L2.8 IC16_L2.4), U_LPCB220 - IBEAM INTERFACE/L3 (C36_L3.2 CN12_L3.7 CN12_L3.8 IC16_L3.4), LPCB220 - CORE A (CN8.GND1 CN8.GND2 CN8.GND3 CN8.GND4), LPCB220 - REMOTE ACCELS (24 pins), LPCB220 - CORE B (CN9.GND1 CN9.GND2 CN9.GND3 CN9.GND4), LPCB220 - G210X MUX INTERFACE (15 pins), LPCB220 - THROTTLE MUX TOP (10 pins), U_LPCB220 - THROTTLE MUX TOP/TH1 (C51_TH1.2 IC20_TH1.3 IC20_TH1.4 R20_TH1.1), U_LPCB220 - THROTTLE MUX TOP/TH2 (C51_TH2.2 IC20_TH2.3 IC20_TH2.4 R20_TH2.1), U_LPCB220 - THROTTLE MUX TOP/TH3 (C51_TH3.2 IC20_TH3.3 IC20_TH3.4 R20_TH3.1), U_LPCB220 - THROTTLE MUX TOP/TH4 (C51_TH4.2 IC20_TH4.3 IC20_TH4.4 R20_TH4.1), U_LPCB220 - THROTTLE MUX TOP/TH5 (C51_TH5.2 IC20_TH5.3 IC20_TH5.4 R20_TH5.1), U_LPCB220 - THROTTLE MUX TOP/TH6 (C51_TH6.2 IC20_TH6.3 IC20_TH6.4 R20_TH6.1), U_LPCB220 - THROTTLE MUX TOP/TH7 (C51_TH7.2 IC20_TH7.3 IC20_TH7.4 R20_TH7.1), U_LPCB220 - THROTTLE MUX TOP/TH8 (C51_TH8.2 IC20_TH8.3 IC20_TH8.4 R20_TH8.1)
P5VA: LPCB220 - AUXPROP INTERFACE (C1.1 IC1.22), LPCB220 - DAC A (8 pins), U_LPCB220 - IBEAM INTERFACE/L1 (C36_L1.1 IC16_L1.1), U_LPCB220 - IBEAM INTERFACE/L2 (C36_L2.1 IC16_L2.1), U_LPCB220 - IBEAM INTERFACE/L3 (C36_L3.1 IC16_L3.1), LPCB220 - CORE A (CN8.P5V1 CN8.P5V2), LPCB220 - REMOTE ACCELS (CN1.2), LPCB220 - G210X MUX INTERFACE (C27.1 CN10.4 CN10.5 IC13.16), LPCB220 - THROTTLE MUX TOP (C52.1 C53.1 IC21.22 IC22.22), U_LPCB220 - THROTTLE MUX TOP/TH1 (C51_TH1.1 IC20_TH1.1), U_LPCB220 - THROTTLE MUX TOP/TH2 (C51_TH2.1 IC20_TH2.1), U_LPCB220 - THROTTLE MUX TOP/TH3 (C51_TH3.1 IC20_TH3.1), U_LPCB220 - THROTTLE MUX TOP/TH4 (C51_TH4.1 IC20_TH4.1), U_LPCB220 - THROTTLE MUX TOP/TH5 (C51_TH5.1 IC20_TH5.1), U_LPCB220 - THROTTLE MUX TOP/TH6 (C51_TH6.1 IC20_TH6.1), U_LPCB220 - THROTTLE MUX TOP/TH7 (C51_TH7.1 IC20_TH7.1), U_LPCB220 - THROTTLE MUX TOP/TH8 (C51_TH8.1 IC20_TH8.1)
P5VB: LPCB220 - DAC B (8 pins), LPCB220 - REMOTE ACCELS (CN2.2), LPCB220 - CORE B (CN9.P5V1 CN9.P5V2)
P24VA: LPCB220 - BRAKE FAILSAFE (D2.3 RLY2.1), LPCB220 - MLP INTERFACE (D3.1 D4.1), U_LPCB220 - MLP INTERFACE/BL1 (C22_BL1.1 C23_BL1.1 IC11_BL1.16), U_LPCB220 - MLP INTERFACE/BL2 (C22_BL2.1 C23_BL2.1 IC11_BL2.16), LPCB220 - AUXPROP INTERFACE (D1.3 RLY1.1), U_LPCB220 - IBEAM INTERFACE/L1 (CN12_L1.1), U_LPCB220 - IBEAM INTERFACE/L2 (CN12_L2.1), U_LPCB220 - IBEAM INTERFACE/L3 (CN12_L3.1), LPCB220 - CORE A (CN8.P24V1 CN8.P24V2)
A_AP_THROTTLE1: LPCB220 - AUXPROP INTERFACE (IC1.19), LPCB220 - DAC A (IC9.53)
A_AP_THROTTLE2: LPCB220 - AUXPROP INTERFACE (IC1.17), LPCB220 - DAC A (IC9.59)
A_HE_THROTTLE1: LPCB220 - DAC A (IC9.26), LPCB220 - THROTTLE MUX TOP (IC21.19)
A_HE_THROTTLE2: LPCB220 - DAC A (IC9.25), LPCB220 - THROTTLE MUX TOP (IC21.17)
A_HE_THROTTLE3: LPCB220 - DAC A (IC9.24), LPCB220 - THROTTLE MUX TOP (IC21.10)
A_HE_THROTTLE4: LPCB220 - DAC A (IC9.20), LPCB220 - THROTTLE MUX TOP (IC21.8)
A_HE_THROTTLE5: LPCB220 - DAC A (IC9.19), LPCB220 - THROTTLE MUX TOP (IC22.19)
A_HE_THROTTLE6: LPCB220 - DAC A (IC9.18), LPCB220 - THROTTLE MUX TOP (IC22.17)
A_HE_THROTTLE7: LPCB220 - DAC A (IC9.51), LPCB220 - THROTTLE MUX TOP (IC22.10)
A_HE_THROTTLE8: LPCB220 - DAC A (IC9.52), LPCB220 - THROTTLE MUX TOP (IC22.8)
B_AP_THROTTLE1: LPCB220 - AUXPROP INTERFACE (IC1.18), LPCB220 - DAC B (IC10.53)
B_AP_THROTTLE2: LPCB220 - AUXPROP INTERFACE (IC1.15), LPCB220 - DAC B (IC10.59)
B_HE_THROTTLE1: LPCB220 - DAC B (IC10.26), LPCB220 - THROTTLE MUX TOP (IC21.18)
B_HE_THROTTLE2: LPCB220 - DAC B (IC10.25), LPCB220 - THROTTLE MUX TOP (IC21.15)
B_HE_THROTTLE3: LPCB220 - DAC B (IC10.24), LPCB220 - THROTTLE MUX TOP (IC21.12)
B_HE_THROTTLE4: LPCB220 - DAC B (IC10.20), LPCB220 - THROTTLE MUX TOP (IC21.9)
B_HE_THROTTLE5: LPCB220 - DAC B (IC10.19), LPCB220 - THROTTLE MUX TOP (IC22.18)
B_HE_THROTTLE6: LPCB220 - DAC B (IC10.18), LPCB220 - THROTTLE MUX TOP (IC22.15)
B_HE_THROTTLE7: LPCB220 - DAC B (IC10.51), LPCB220 - THROTTLE MUX TOP (IC22.12)
B_HE_THROTTLE8: LPCB220 - DAC B (IC10.52), LPCB220 - THROTTLE MUX TOP (IC22.9)
BL_MA420IN1: LPCB220 - MLP INTERFACE (CN13.2), U_LPCB220 - MLP INTERFACE/BL1 (IC11_BL1.3)
BL_MA420IN2: LPCB220 - MLP INTERFACE (CN13.4), U_LPCB220 - MLP INTERFACE/BL2 (IC11_BL2.3)
BRAKE1_SW_EXT: LPCB220 - CORE A (CN8.T12), LPCB220 - CORE B (CN9.T12), LPCB220 - G210X MUX INTERFACE (IC14.12 TP22.1)
BRAKE1_SW_RET: LPCB220 - CORE A (CN8.T13), LPCB220 - CORE B (CN9.T13), LPCB220 - G210X MUX INTERFACE (IC14.9 TP23.1)
BRAKE2_SW_EXT: LPCB220 - CORE A (CN8.T22), LPCB220 - CORE B (CN9.T22), LPCB220 - G210X MUX INTERFACE (IC15.12)
BRAKE2_SW_RET: LPCB220 - CORE A (CN8.T23), LPCB220 - CORE B (CN9.T23), LPCB220 - G210X MUX INTERFACE (IC15.9)
BRAKE_MLP1: U_LPCB220 - MLP INTERFACE/BL1 (5 pins), LPCB220 - CORE A (CN8.A10), LPCB220 - CORE B (CN9.A10)
BRAKE_MLP2: U_LPCB220 - MLP INTERFACE/BL2 (5 pins), LPCB220 - CORE A (CN8.A11), LPCB220 - CORE B (CN9.A11)
CHA_ACCEL0_NINT: LPCB220 - CORE A (CN8.T2), LPCB220 - REMOTE ACCELS (IC19.9)
CHA_ACCEL1_NINT: LPCB220 - CORE A (CN8.T5), LPCB220 - REMOTE ACCELS (IC19.12)
CHA_AUXPROP_DIR: LPCB220 - AUXPROP INTERFACE (IC1.10), LPCB220 - CORE A (CN8.T6)
CHA_BRAKE1_DIR: LPCB220 - CORE A (CN8.T24), LPCB220 - G210X MUX INTERFACE (IC13.3)
CHA_BRAKE1_STEP: LPCB220 - CORE A (CN8.T25), LPCB220 - G210X MUX INTERFACE (IC13.10)
CHA_BRAKE2_DIR: LPCB220 - CORE A (CN8.T26), LPCB220 - G210X MUX INTERFACE (IC13.6)
CHA_BRAKE2_STEP: LPCB220 - CORE A (CN8.T27), LPCB220 - G210X MUX INTERFACE (IC13.13)
CHA_DAC_NCNVT: LPCB220 - DAC A (IC9.3 TP5.1), LPCB220 - CORE A (CN8.T21)
CHA_DAC_NDAV: LPCB220 - DAC A (IC9.2 R10.1 TP1.1), LPCB220 - CORE A (CN8.T11)
CHA_DAC_NRST: LPCB220 - DAC A (IC9.1 TP2.1), LPCB220 - CORE A (CN8.T20)
CHA_I2C_SCL: LPCB220 - DAC A (IC9.5 TP6.1), LPCB220 - CORE A (CN8.SCL), LPCB220 - REMOTE ACCELS (IC3.7)
CHA_I2C_SDA: LPCB220 - DAC A (IC9.4 TP7.1), LPCB220 - CORE A (CN8.SDA), LPCB220 - REMOTE ACCELS (IC3.1)
CHA_NDSC_CLR0: LPCB220 - DAC A (IC9.17 TP4.1), LPCB220 - CORE A (CN8.T16)
CHA_NDSC_CLR1: LPCB220 - DAC A (IC9.63 TP3.1), LPCB220 - CORE A (CN8.T17)
CHA_WDT_PULSE: LPCB220 - WATCHDOG (IC23.4), LPCB220 - CORE A (CN8.T28)
CHB_ACCEL0_NINT: LPCB220 - REMOTE ACCELS (IC5.9), LPCB220 - CORE B (CN9.T2)
CHB_ACCEL1_NINT: LPCB220 - REMOTE ACCELS (IC5.12), LPCB220 - CORE B (CN9.T5)
CHB_AUXPROP_DIR: LPCB220 - AUXPROP INTERFACE (IC1.12), LPCB220 - CORE B (CN9.T6)
CHB_BRAKE1_DIR: LPCB220 - CORE B (CN9.T24), LPCB220 - G210X MUX INTERFACE (IC13.2)
CHB_BRAKE1_STEP: LPCB220 - CORE B (CN9.T25), LPCB220 - G210X MUX INTERFACE (IC13.11)
CHB_BRAKE2_DIR: LPCB220 - CORE B (CN9.T26), LPCB220 - G210X MUX INTERFACE (IC13.5)
CHB_BRAKE2_STEP: LPCB220 - CORE B (CN9.T27), LPCB220 - G210X MUX INTERFACE (IC13.14)
CHB_DAC_NCNVT: LPCB220 - DAC B (IC10.3 TP12.1), LPCB220 - CORE B (CN9.T21)
CHB_DAC_NDAV: LPCB220 - DAC B (IC10.2 R11.1 TP8.1), LPCB220 - CORE B (CN9.T11)
CHB_DAC_NRST: LPCB220 - DAC B (IC10.1 TP9.1), LPCB220 - CORE B (CN9.T20)
CHB_I2C_SCL: LPCB220 - DAC B (IC10.5 TP13.1), LPCB220 - REMOTE ACCELS (IC4.7), LPCB220 - CORE B (CN9.SCL)
CHB_I2C_SDA: LPCB220 - DAC B (IC10.4 TP14.1), LPCB220 - REMOTE ACCELS (IC4.1), LPCB220 - CORE B (CN9.SDA)
CHB_NDSC_CLR0: LPCB220 - DAC B (IC10.17 TP11.1), LPCB220 - CORE B (CN9.T16)
CHB_NDSC_CLR1: LPCB220 - DAC B (IC10.63 TP10.1), LPCB220 - CORE B (CN9.T17)
CHB_WDT_PULSE: LPCB220 - WATCHDOG (IC25.4), LPCB220 - CORE B (CN9.T28)
HEC_5V1: U_LPCB220 - THROTTLE MUX TOP/TH1 (C49_TH1.2 C50_TH1.2 IC20_TH1.8), LPCB220 - THROTTLE CONNECTORS (CN16.1)
HEC_5V2: U_LPCB220 - THROTTLE MUX TOP/TH2 (C49_TH2.2 C50_TH2.2 IC20_TH2.8), LPCB220 - THROTTLE CONNECTORS (CN16.6)
HEC_5V3: U_LPCB220 - THROTTLE MUX TOP/TH3 (C49_TH3.2 C50_TH3.2 IC20_TH3.8), LPCB220 - THROTTLE CONNECTORS (CN17.1)
HEC_5V4: U_LPCB220 - THROTTLE MUX TOP/TH4 (C49_TH4.2 C50_TH4.2 IC20_TH4.8), LPCB220 - THROTTLE CONNECTORS (CN17.6)
HEC_5V5: U_LPCB220 - THROTTLE MUX TOP/TH5 (C49_TH5.2 C50_TH5.2 IC20_TH5.8), LPCB220 - THROTTLE CONNECTORS (CN18.1)
HEC_5V6: U_LPCB220 - THROTTLE MUX TOP/TH6 (C49_TH6.2 C50_TH6.2 IC20_TH6.8), LPCB220 - THROTTLE CONNECTORS (CN18.6)
HEC_5V7: U_LPCB220 - THROTTLE MUX TOP/TH7 (C49_TH7.2 C50_TH7.2 IC20_TH7.8), LPCB220 - THROTTLE CONNECTORS (CN19.1)
HEC_5V8: U_LPCB220 - THROTTLE MUX TOP/TH8 (C49_TH8.2 C50_TH8.2 IC20_TH8.8), LPCB220 - THROTTLE CONNECTORS (CN19.6)
HEC_GND1: U_LPCB220 - THROTTLE MUX TOP/TH1 (C49_TH1.1 C50_TH1.1 IC20_TH1.5 IC20_TH1.6), LPCB220 - THROTTLE CONNECTORS (CN16.3)
HEC_GND2: U_LPCB220 - THROTTLE MUX TOP/TH2 (C49_TH2.1 C50_TH2.1 IC20_TH2.5 IC20_TH2.6), LPCB220 - THROTTLE CONNECTORS (CN16.8)
HEC_GND3: U_LPCB220 - THROTTLE MUX TOP/TH3 (C49_TH3.1 C50_TH3.1 IC20_TH3.5 IC20_TH3.6), LPCB220 - THROTTLE CONNECTORS (CN17.3)
HEC_GND4: U_LPCB220 - THROTTLE MUX TOP/TH4 (C49_TH4.1 C50_TH4.1 IC20_TH4.5 IC20_TH4.6), LPCB220 - THROTTLE CONNECTORS (CN17.8)
HEC_GND5: U_LPCB220 - THROTTLE MUX TOP/TH5 (C49_TH5.1 C50_TH5.1 IC20_TH5.5 IC20_TH5.6), LPCB220 - THROTTLE CONNECTORS (CN18.3)
HEC_GND6: U_LPCB220 - THROTTLE MUX TOP/TH6 (C49_TH6.1 C50_TH6.1 IC20_TH6.5 IC20_TH6.6), LPCB220 - THROTTLE CONNECTORS (CN18.8)
HEC_GND7: U_LPCB220 - THROTTLE MUX TOP/TH7 (C49_TH7.1 C50_TH7.1 IC20_TH7.5 IC20_TH7.6), LPCB220 - THROTTLE CONNECTORS (CN19.3)
HEC_GND8: U_LPCB220 - THROTTLE MUX TOP/TH8 (C49_TH8.1 C50_TH8.1 IC20_TH8.5 IC20_TH8.6), LPCB220 - THROTTLE CONNECTORS (CN19.8)
HEC_SIG1: U_LPCB220 - THROTTLE MUX TOP/TH1 (IC20_TH1.7), LPCB220 - THROTTLE CONNECTORS (CN16.2)
HEC_SIG2: U_LPCB220 - THROTTLE MUX TOP/TH2 (IC20_TH2.7), LPCB220 - THROTTLE CONNECTORS (CN16.7)
HEC_SIG3: U_LPCB220 - THROTTLE MUX TOP/TH3 (IC20_TH3.7), LPCB220 - THROTTLE CONNECTORS (CN17.2)
HEC_SIG4: U_LPCB220 - THROTTLE MUX TOP/TH4 (IC20_TH4.7), LPCB220 - THROTTLE CONNECTORS (CN17.7)
HEC_SIG5: U_LPCB220 - THROTTLE MUX TOP/TH5 (IC20_TH5.7), LPCB220 - THROTTLE CONNECTORS (CN18.2)
HEC_SIG6: U_LPCB220 - THROTTLE MUX TOP/TH6 (IC20_TH6.7), LPCB220 - THROTTLE CONNECTORS (CN18.7)
HEC_SIG7: U_LPCB220 - THROTTLE MUX TOP/TH7 (IC20_TH7.7), LPCB220 - THROTTLE CONNECTORS (CN19.2)
HEC_SIG8: U_LPCB220 - THROTTLE MUX TOP/TH8 (IC20_TH8.7), LPCB220 - THROTTLE CONNECTORS (CN19.7)
LASER_RX1: U_LPCB220 - IBEAM INTERFACE/L1 (R12_L1.1 TP15_L1.1), LPCB220 - CORE A (CN8.T0), LPCB220 - CORE B (CN9.T0)
LASER_RX2: U_LPCB220 - IBEAM INTERFACE/L2 (R12_L2.1 TP15_L2.1), LPCB220 - CORE A (CN8.T7), LPCB220 - CORE B (CN9.T7)
LASER_RX3: U_LPCB220 - IBEAM INTERFACE/L3 (R12_L3.1 TP15_L3.1), LPCB220 - CORE A (CN8.T9), LPCB220 - CORE B (CN9.T9)
LASER_TX1: U_LPCB220 - IBEAM INTERFACE/L1 (IC16_L1.3 TP16_L1.1), LPCB220 - CORE A (CN8.T1)
LASER_TX2: U_LPCB220 - IBEAM INTERFACE/L2 (IC16_L2.3 TP16_L2.1), LPCB220 - CORE A (CN8.T8)
LASER_TX3: U_LPCB220 - IBEAM INTERFACE/L3 (IC16_L3.3 TP16_L3.1), LPCB220 - CORE A (CN8.T10)
PUSH_INTLK_A: LPCB220 - BRAKE FAILSAFE (IC8.1 TP26.1), LPCB220 - PUSHER INTERLOCK (IC17.12), LPCB220 - CORE A (CN8.T32), LPCB220 - CORE B (CN9.T32)
PUSH_INTLK_B: LPCB220 - BRAKE FAILSAFE (IC8.2 TP27.1), LPCB220 - PUSHER INTERLOCK (IC18.12), LPCB220 - CORE A (CN8.T33), LPCB220 - CORE B (CN9.T33)
STEP_DIR_CTRL: LPCB220 - WATCHDOG (IC23.1 IC24.1 R21.1), LPCB220 - AUXPROP INTERFACE (IC1.14), LPCB220 - G210X MUX INTERFACE (IC13.1), LPCB220 - THROTTLE MUX TOP (IC21.14 IC22.14)
THROT_IN1: LPCB220 - THROTTLE MUX TOP (IC21.20), U_LPCB220 - THROTTLE MUX TOP/TH1 (R19_TH1.2 TP17_TH1.1)
THROT_IN2: LPCB220 - THROTTLE MUX TOP (IC21.16), U_LPCB220 - THROTTLE MUX TOP/TH2 (R19_TH2.2 TP17_TH2.1)
THROT_IN3: LPCB220 - THROTTLE MUX TOP (IC21.11), U_LPCB220 - THROTTLE MUX TOP/TH3 (R19_TH3.2 TP17_TH3.1)
THROT_IN4: LPCB220 - THROTTLE MUX TOP (IC21.7), U_LPCB220 - THROTTLE MUX TOP/TH4 (R19_TH4.2 TP17_TH4.1)
THROT_IN5: LPCB220 - THROTTLE MUX TOP (IC22.20), U_LPCB220 - THROTTLE MUX TOP/TH5 (R19_TH5.2 TP17_TH5.1)
THROT_IN6: LPCB220 - THROTTLE MUX TOP (IC22.16), U_LPCB220 - THROTTLE MUX TOP/TH6 (R19_TH6.2 TP17_TH6.1)
THROT_IN7: LPCB220 - THROTTLE MUX TOP (IC22.11), U_LPCB220 - THROTTLE MUX TOP/TH7 (R19_TH7.2 TP17_TH7.1)
THROT_IN8: LPCB220 - THROTTLE MUX TOP (IC22.7), U_LPCB220 - THROTTLE MUX TOP/TH8 (R19_TH8.2 TP17_TH8.1)
WDT_GOOD: LPCB220 - BRAKE FAILSAFE (IC7.1 TP25.1), LPCB220 - WATCHDOG (IC24.4)